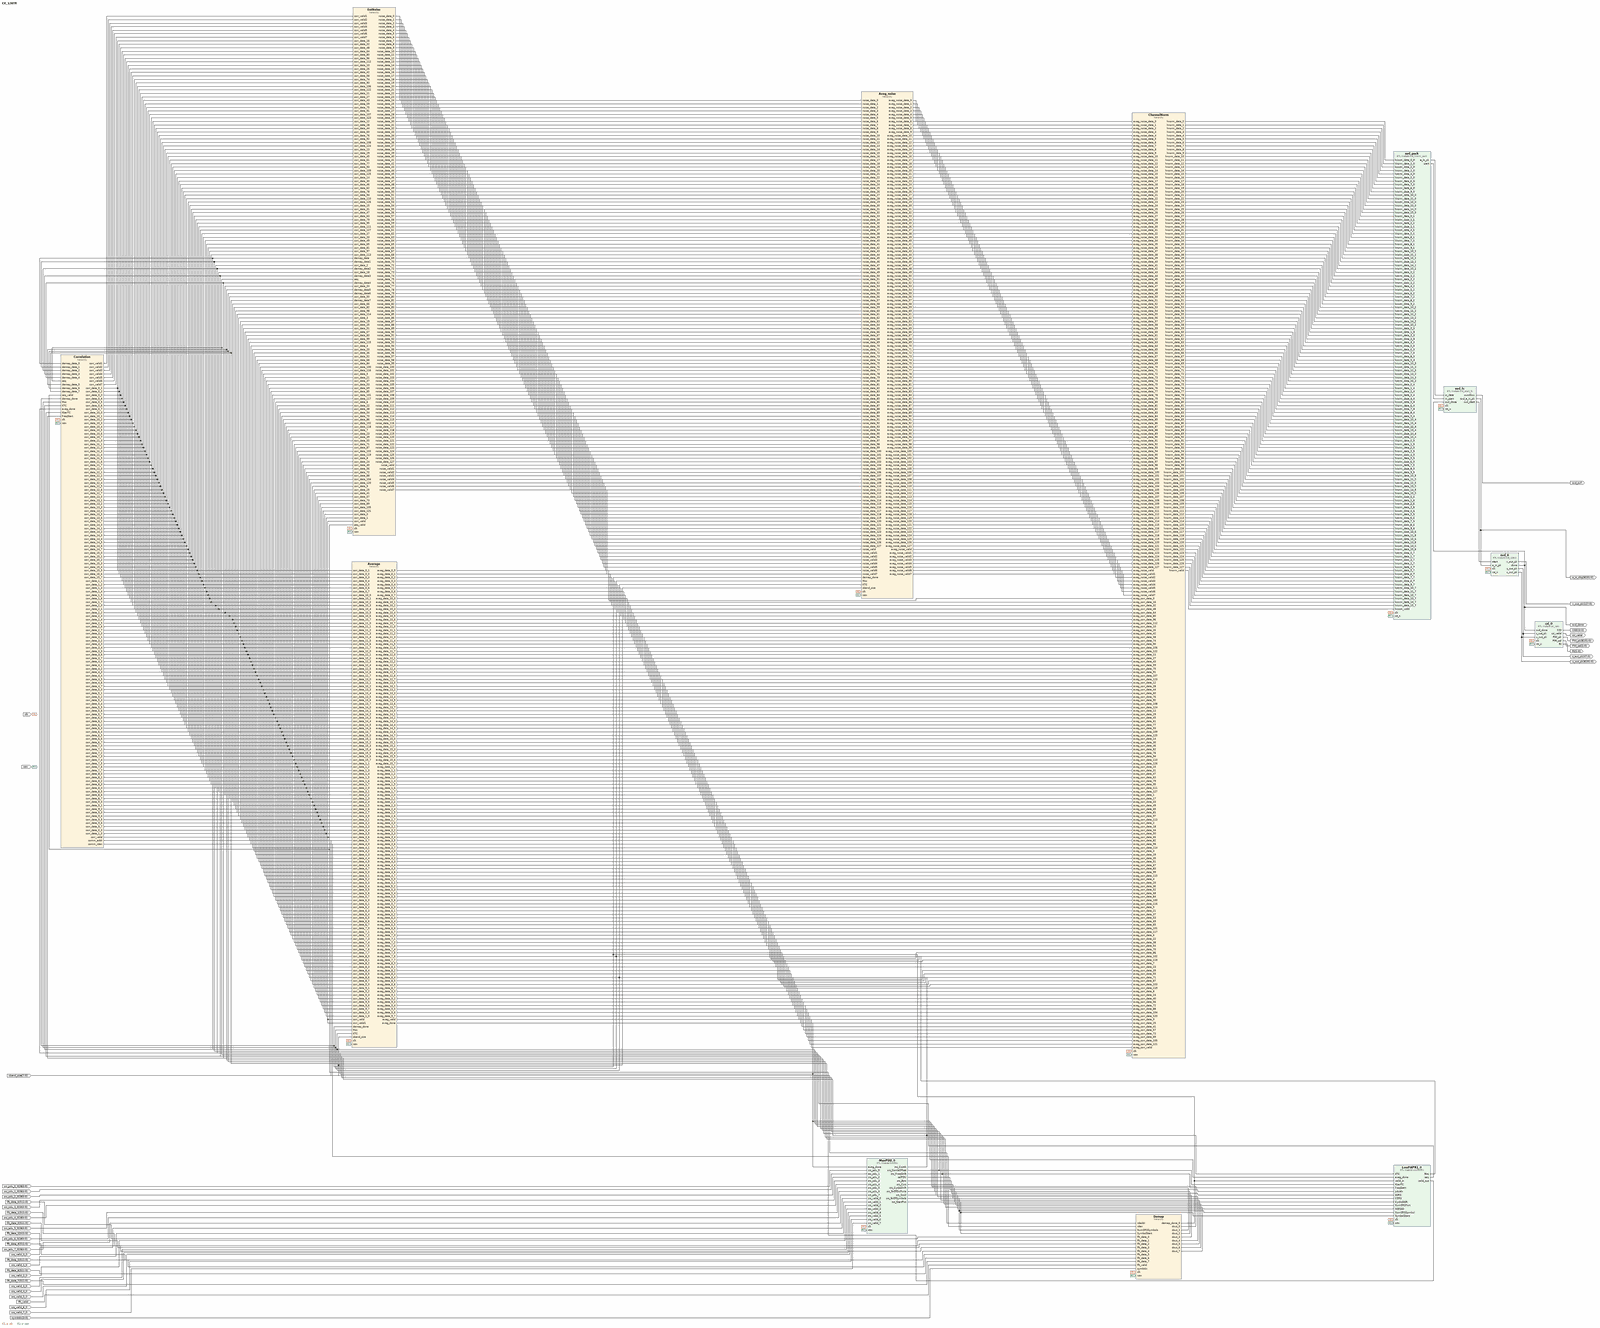
[diagram p0: block diagram of the top level, whole]
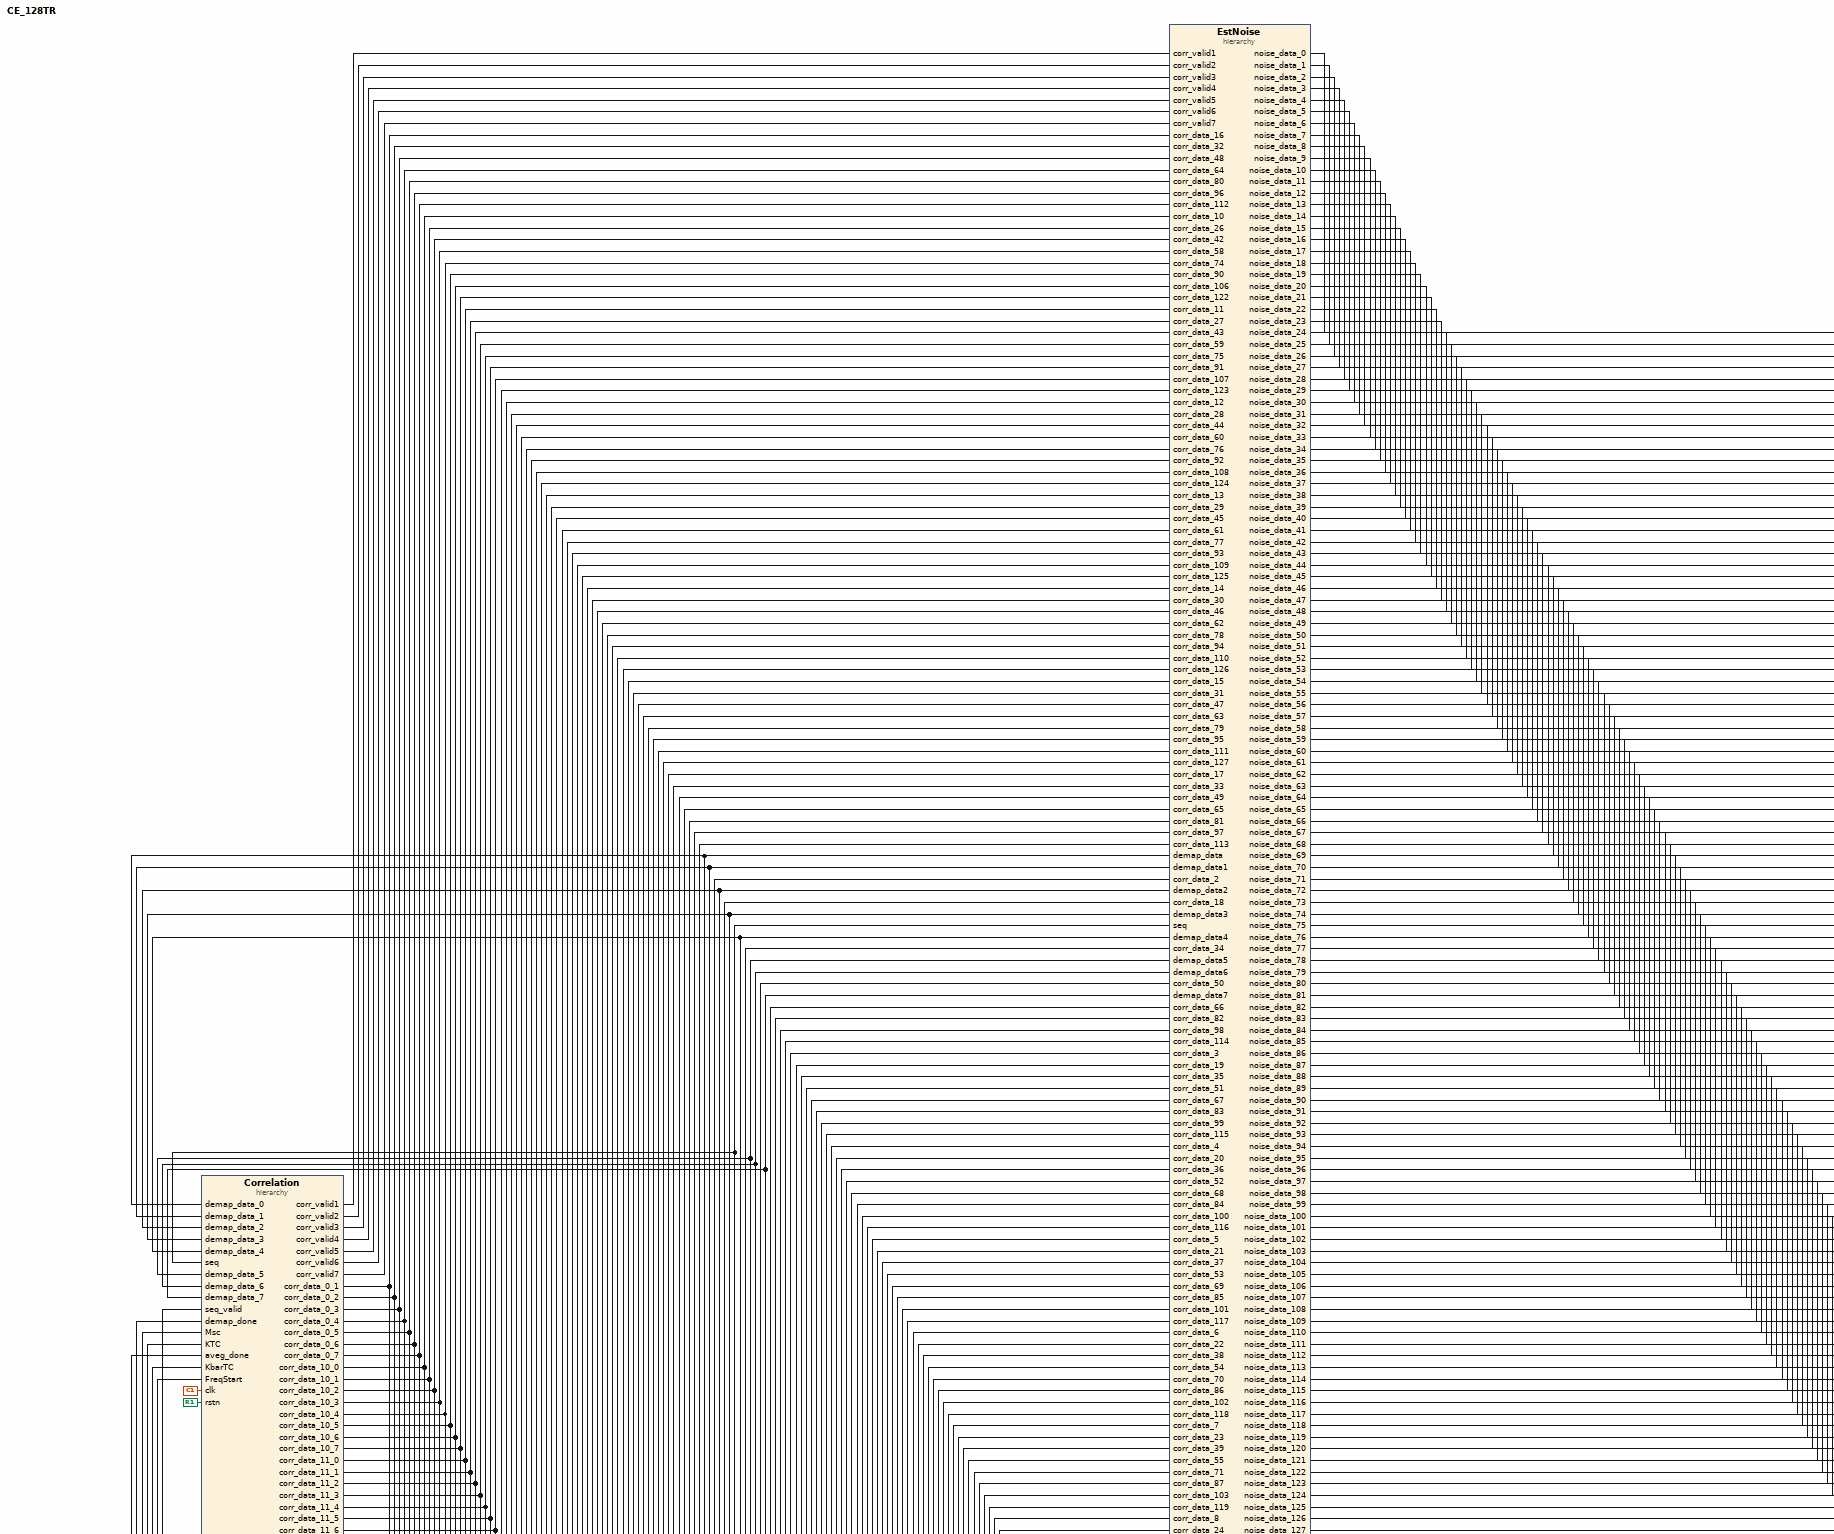
[diagram p1: block diagram of the top level, upper left part]
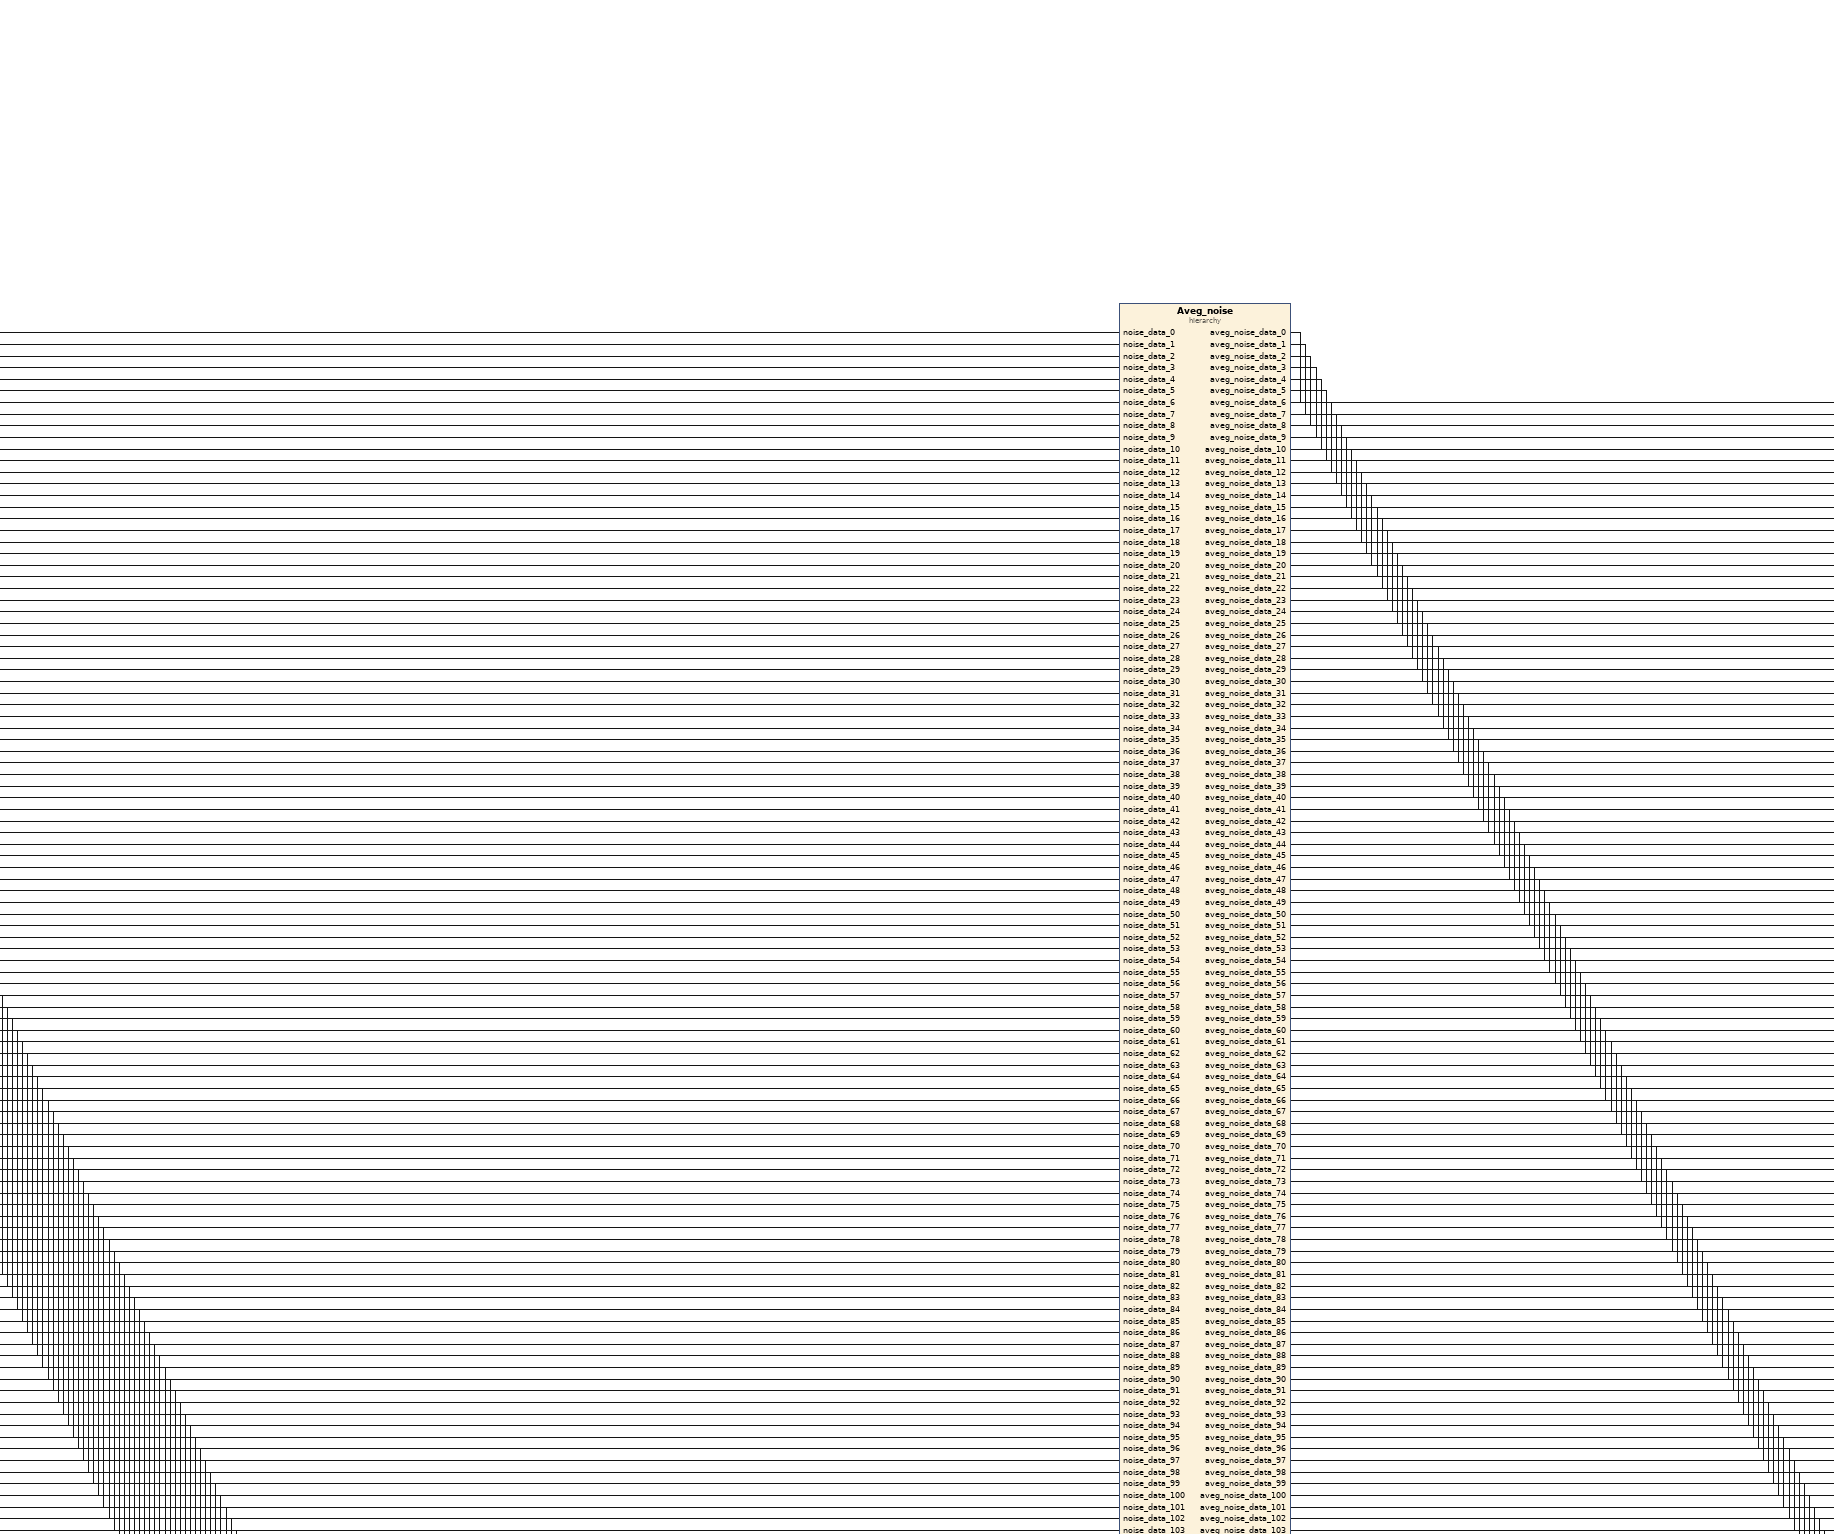
[diagram p2: block diagram of the top level, upper centre part]
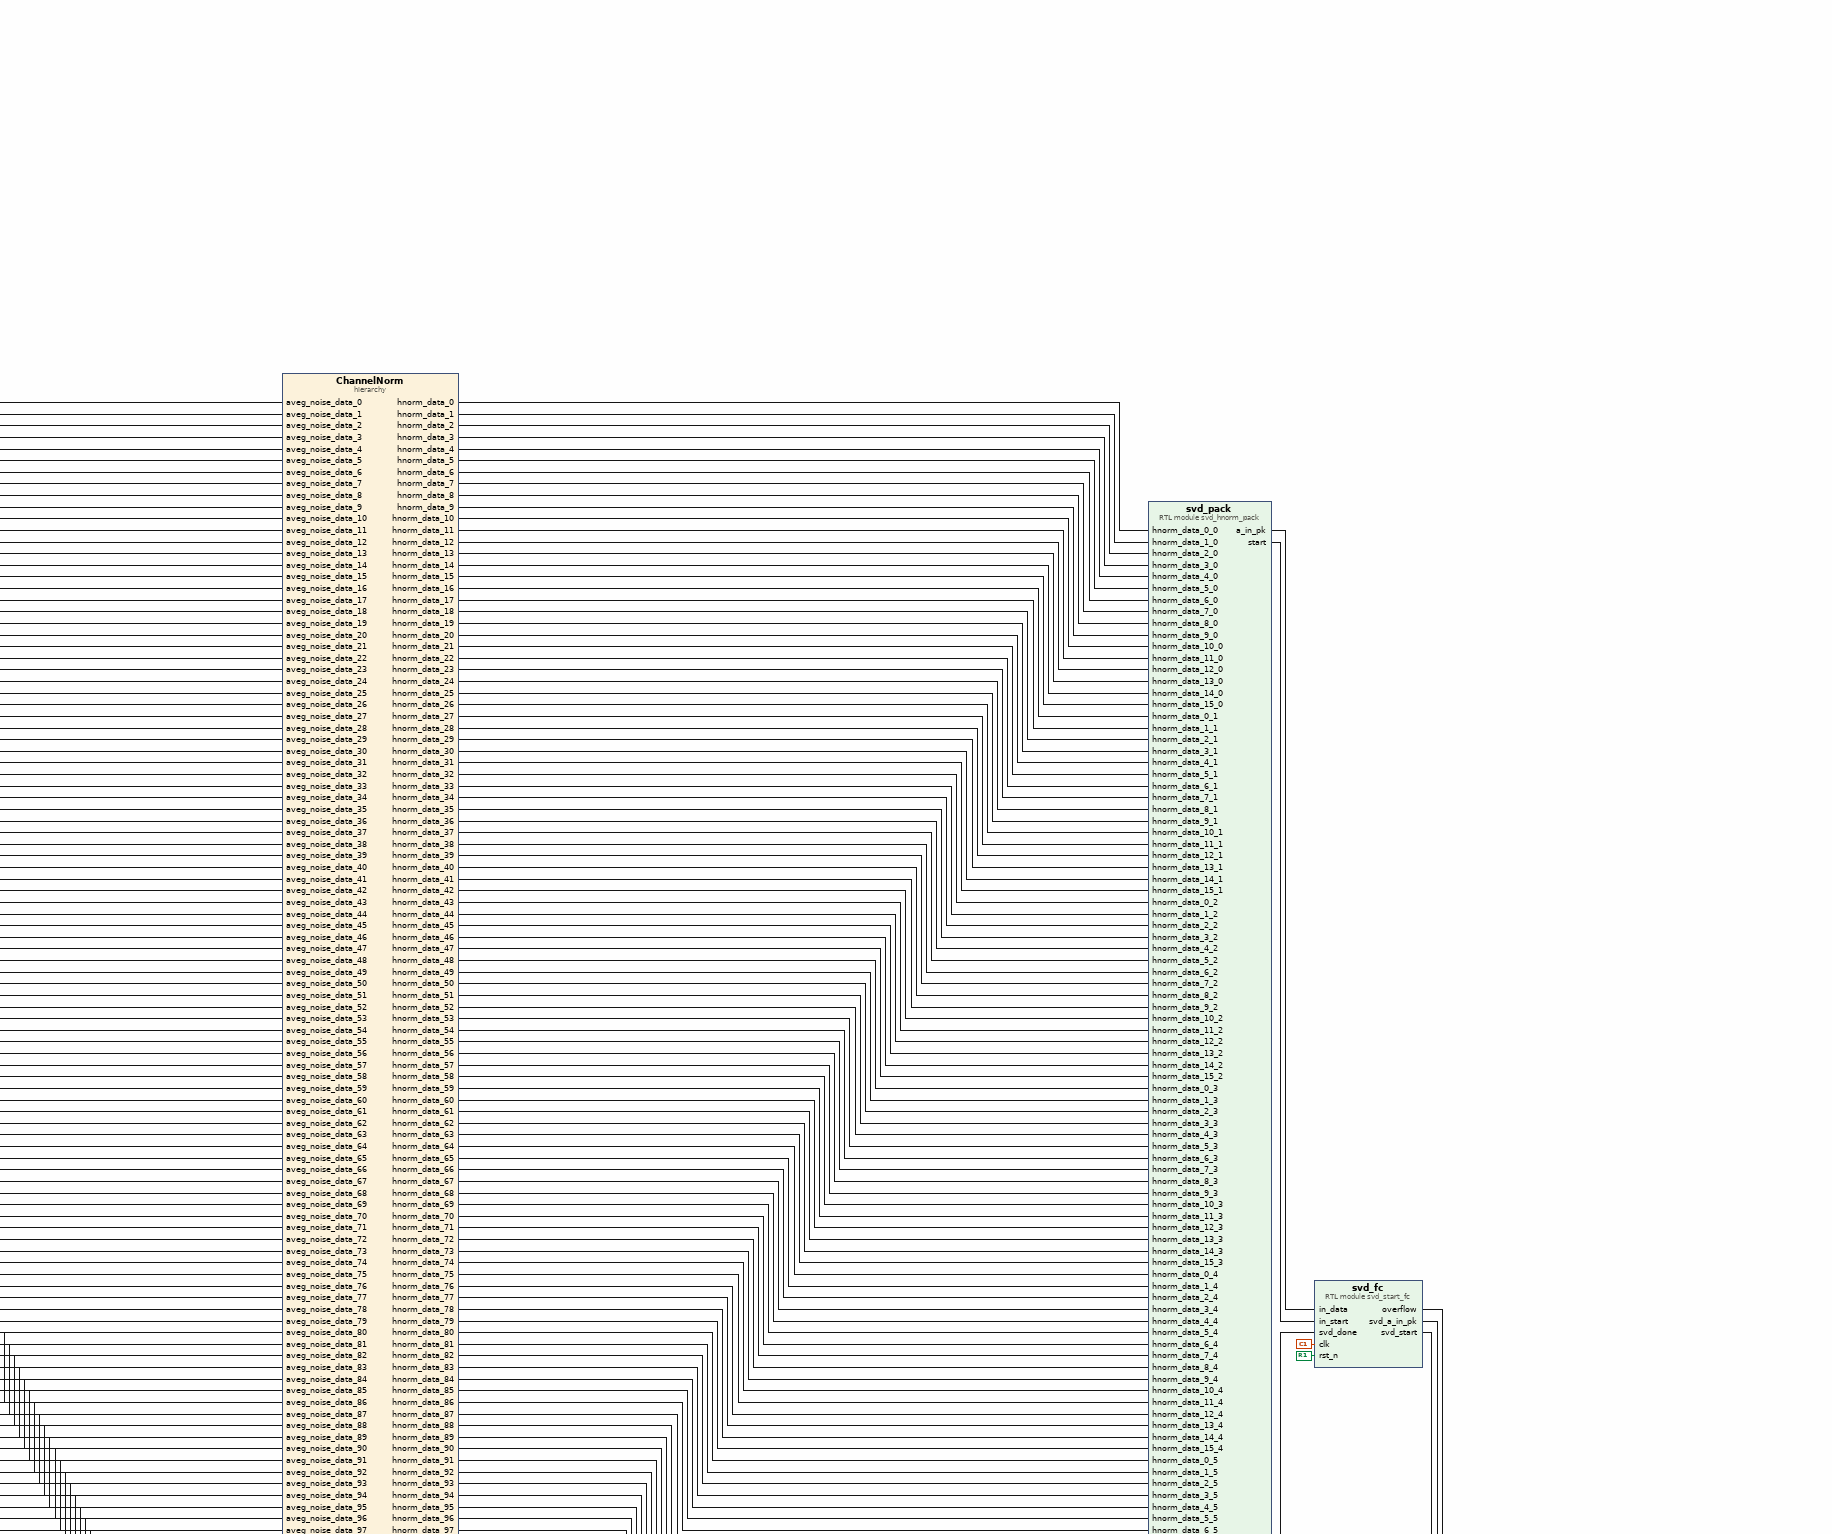
[diagram p3: block diagram of the top level, upper right part]
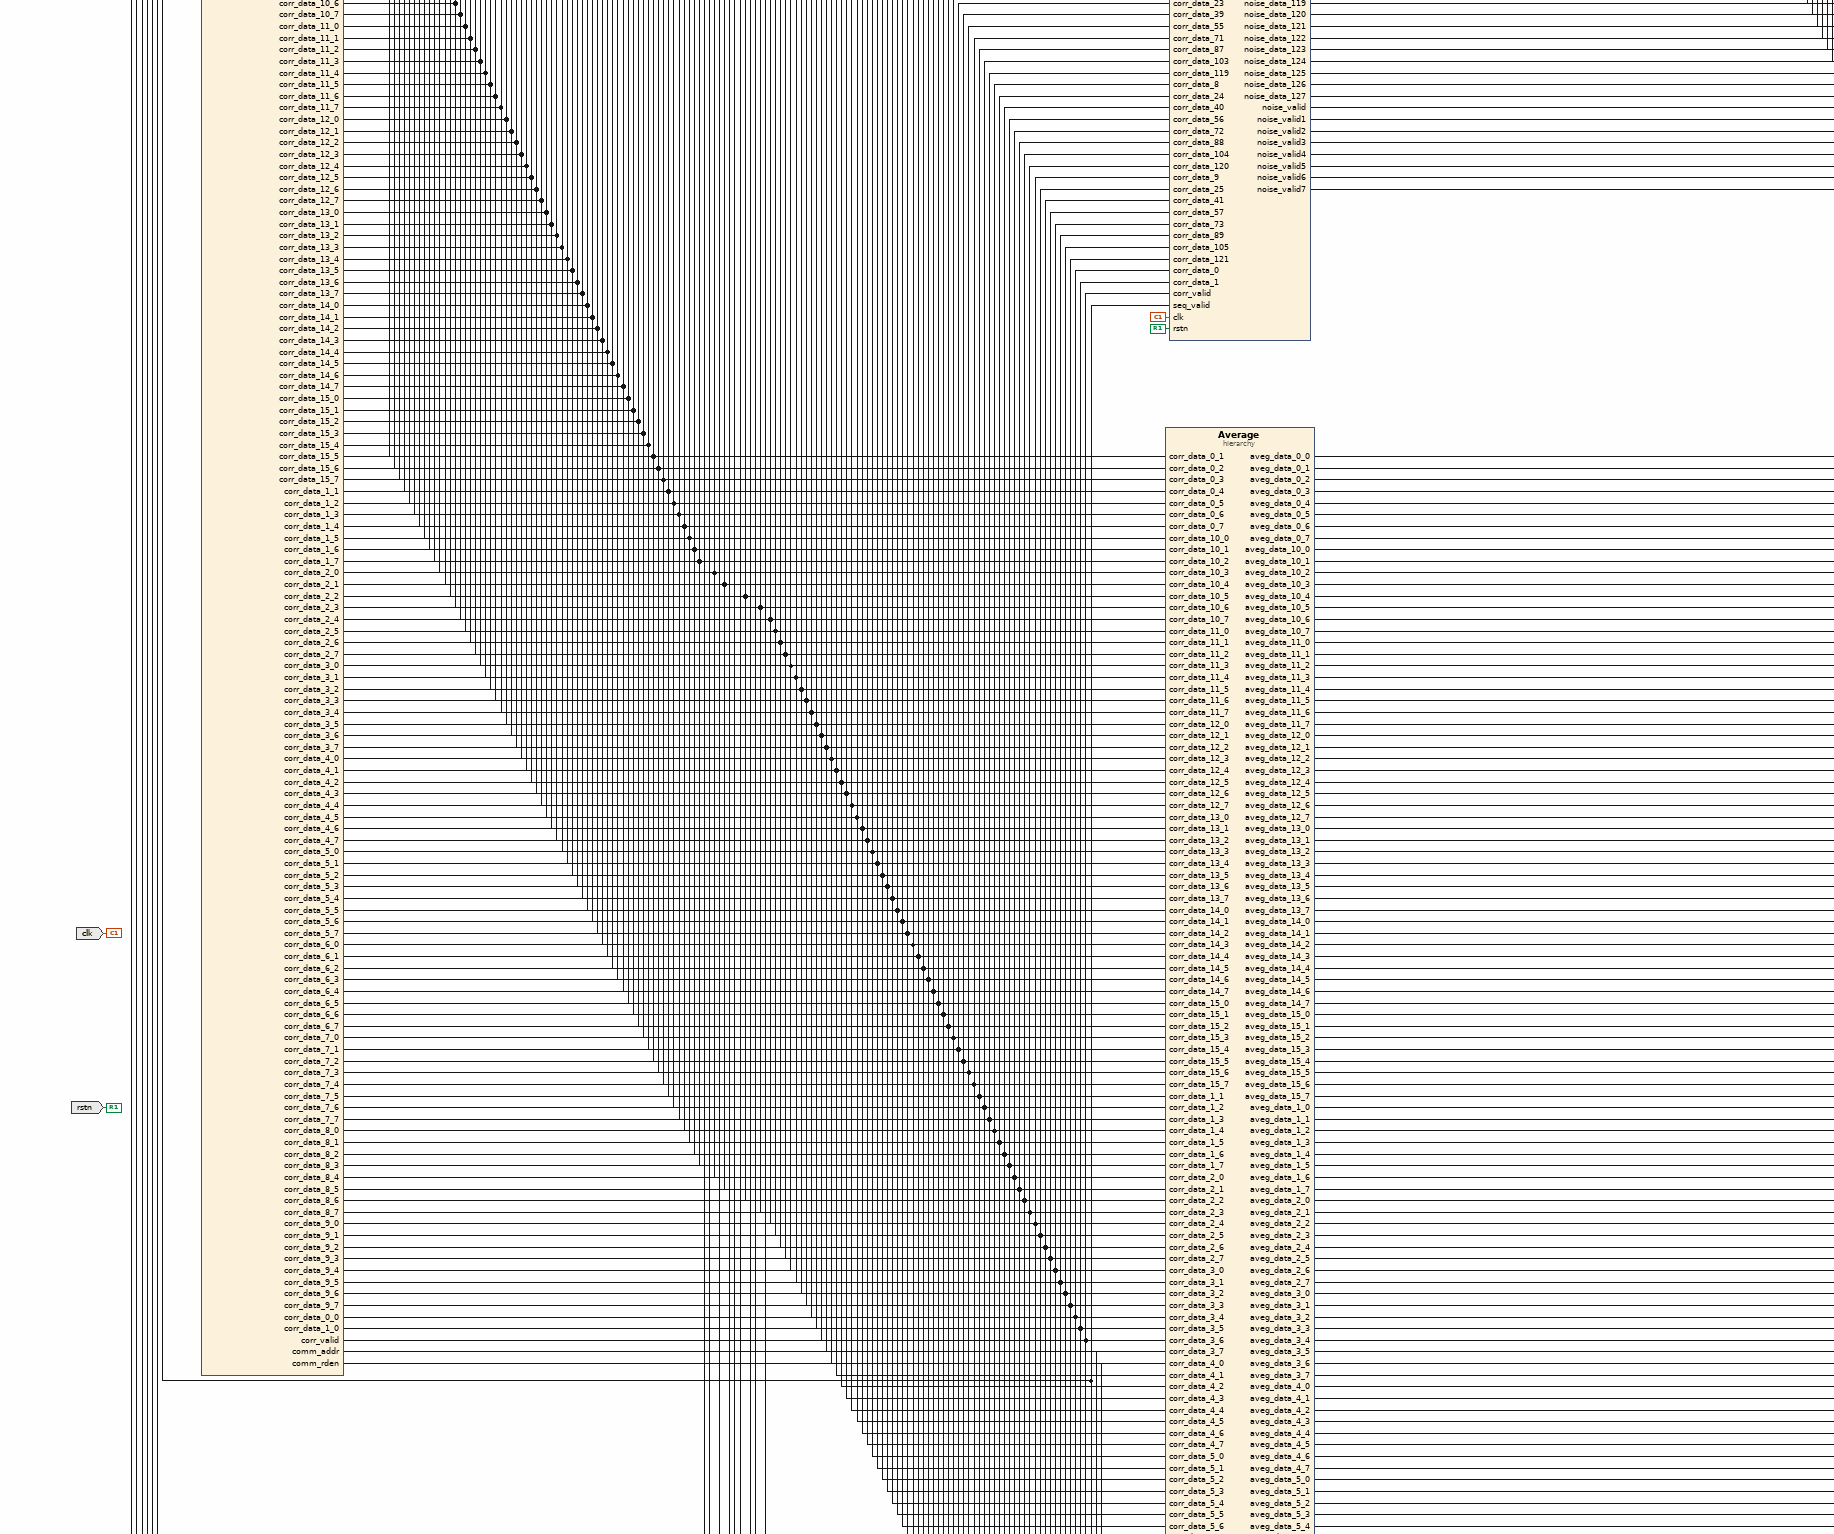
[diagram p4: block diagram of the top level, middle left part]
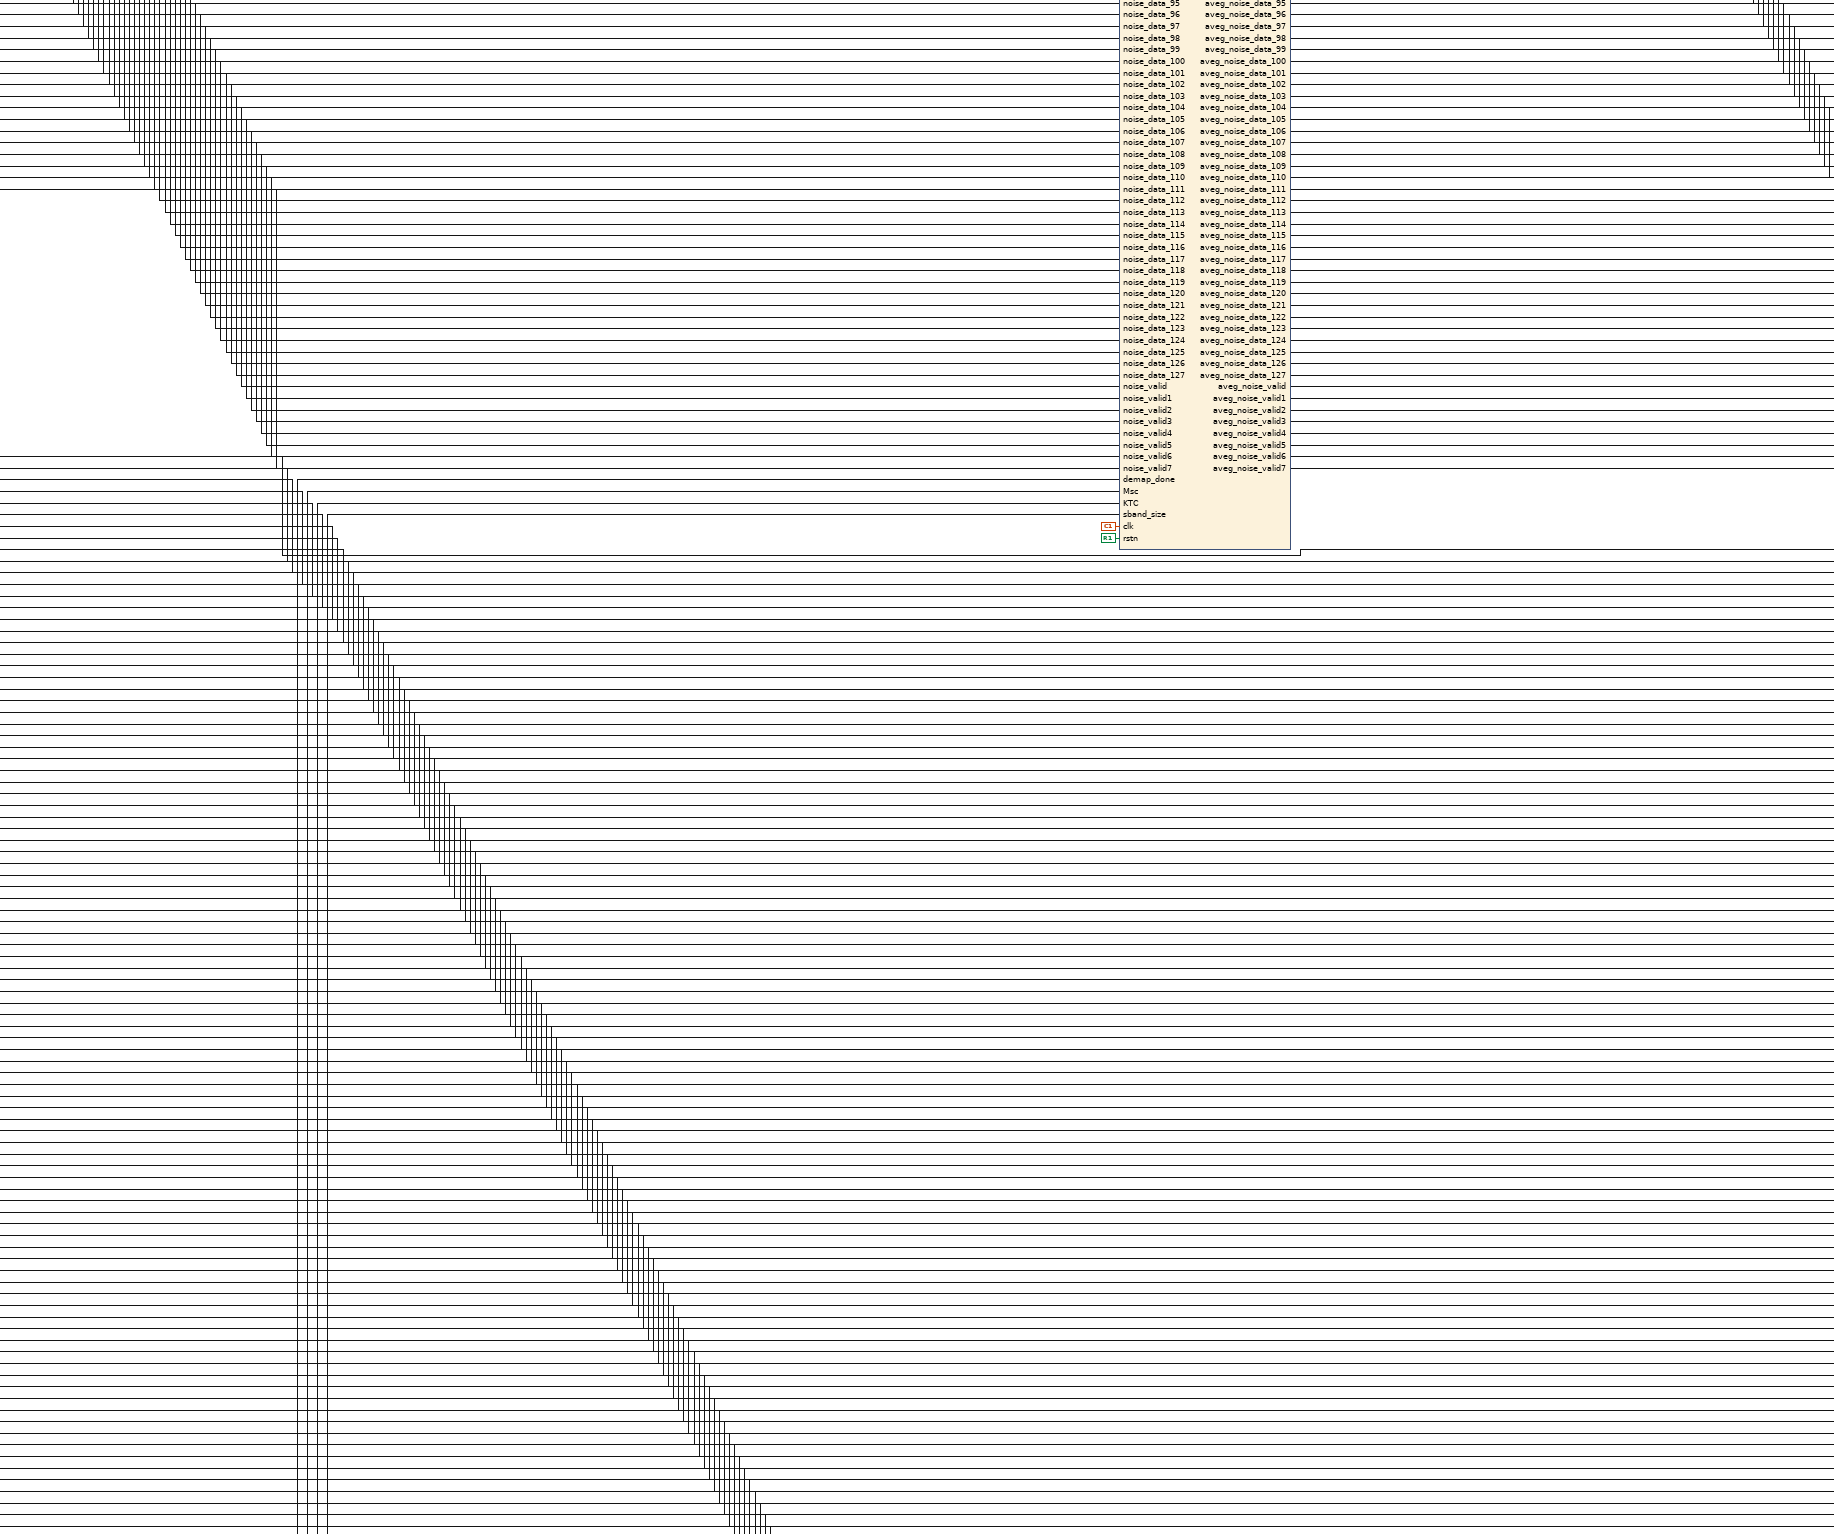
[diagram p5: block diagram of the top level, middle centre part]
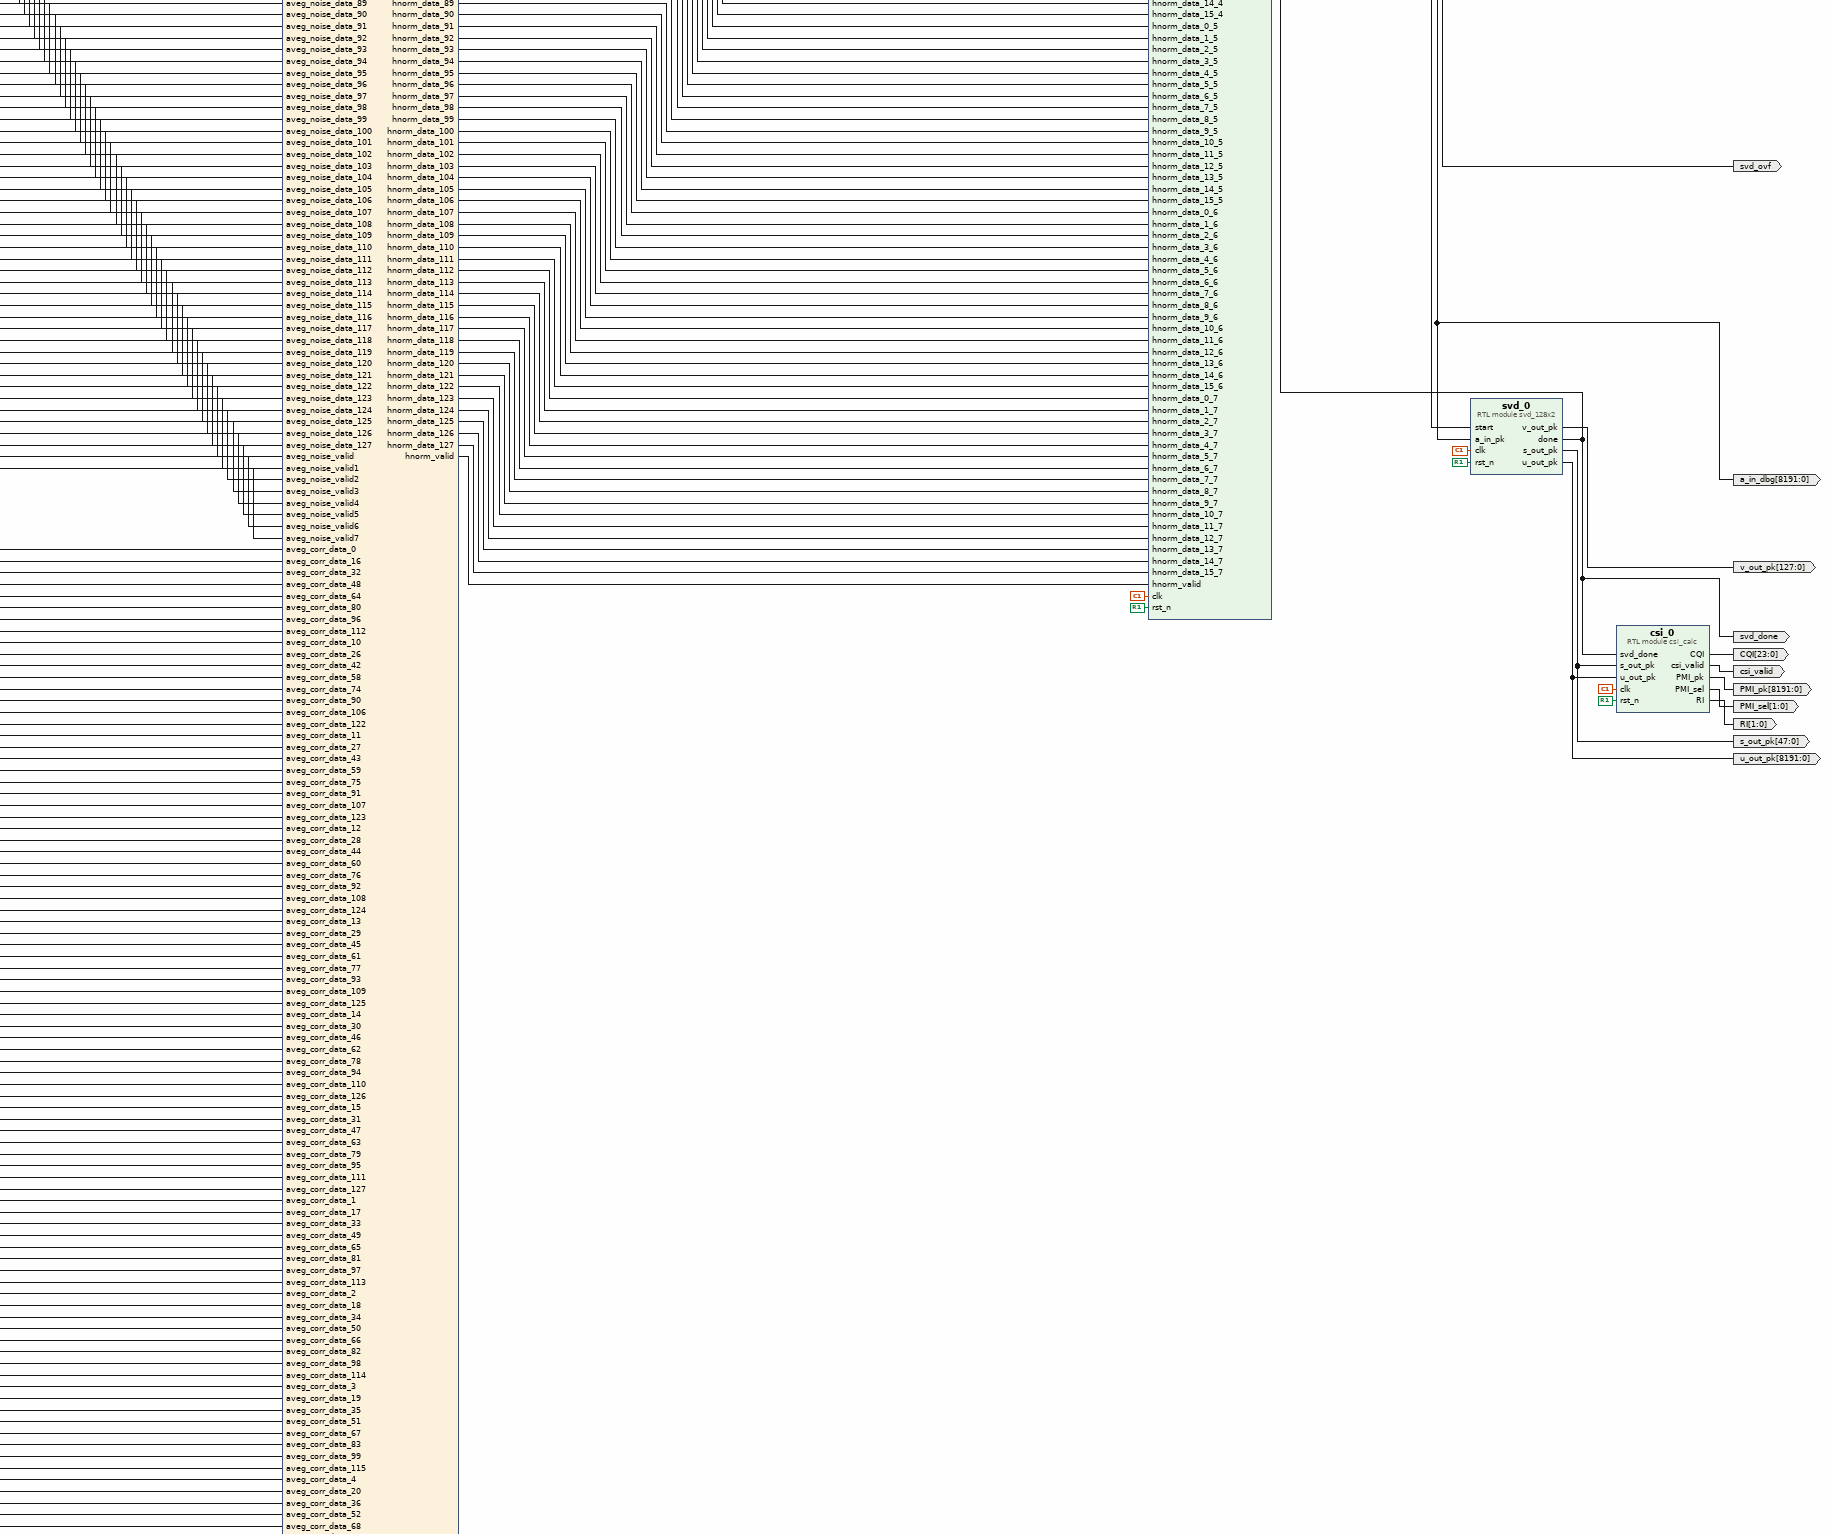
[diagram p6: block diagram of the top level, middle right part]
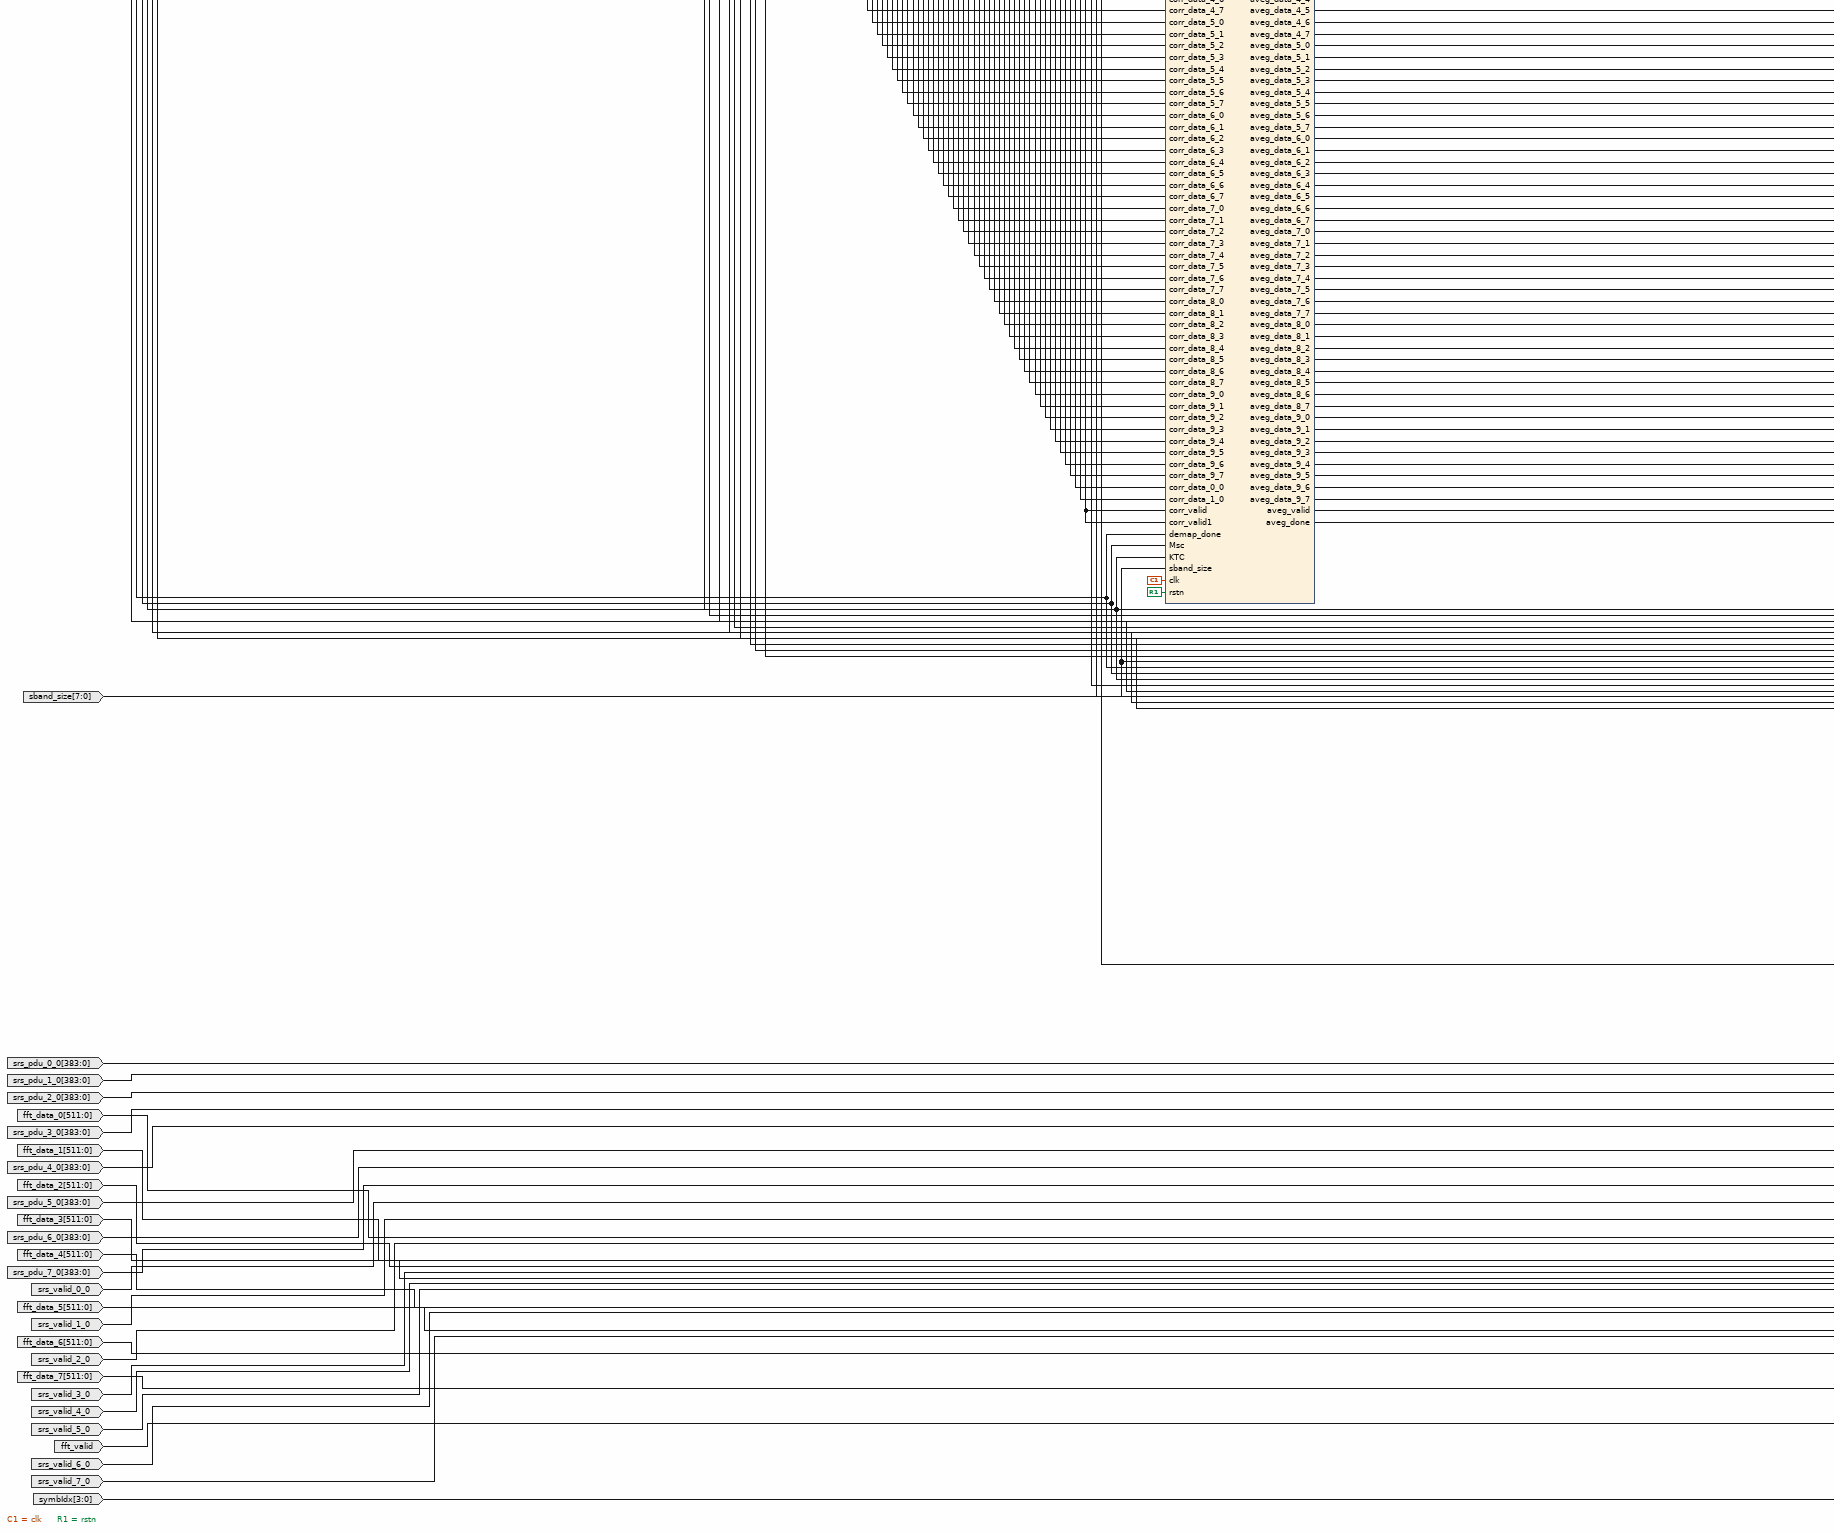
[diagram p7: block diagram of the top level, lower left part]
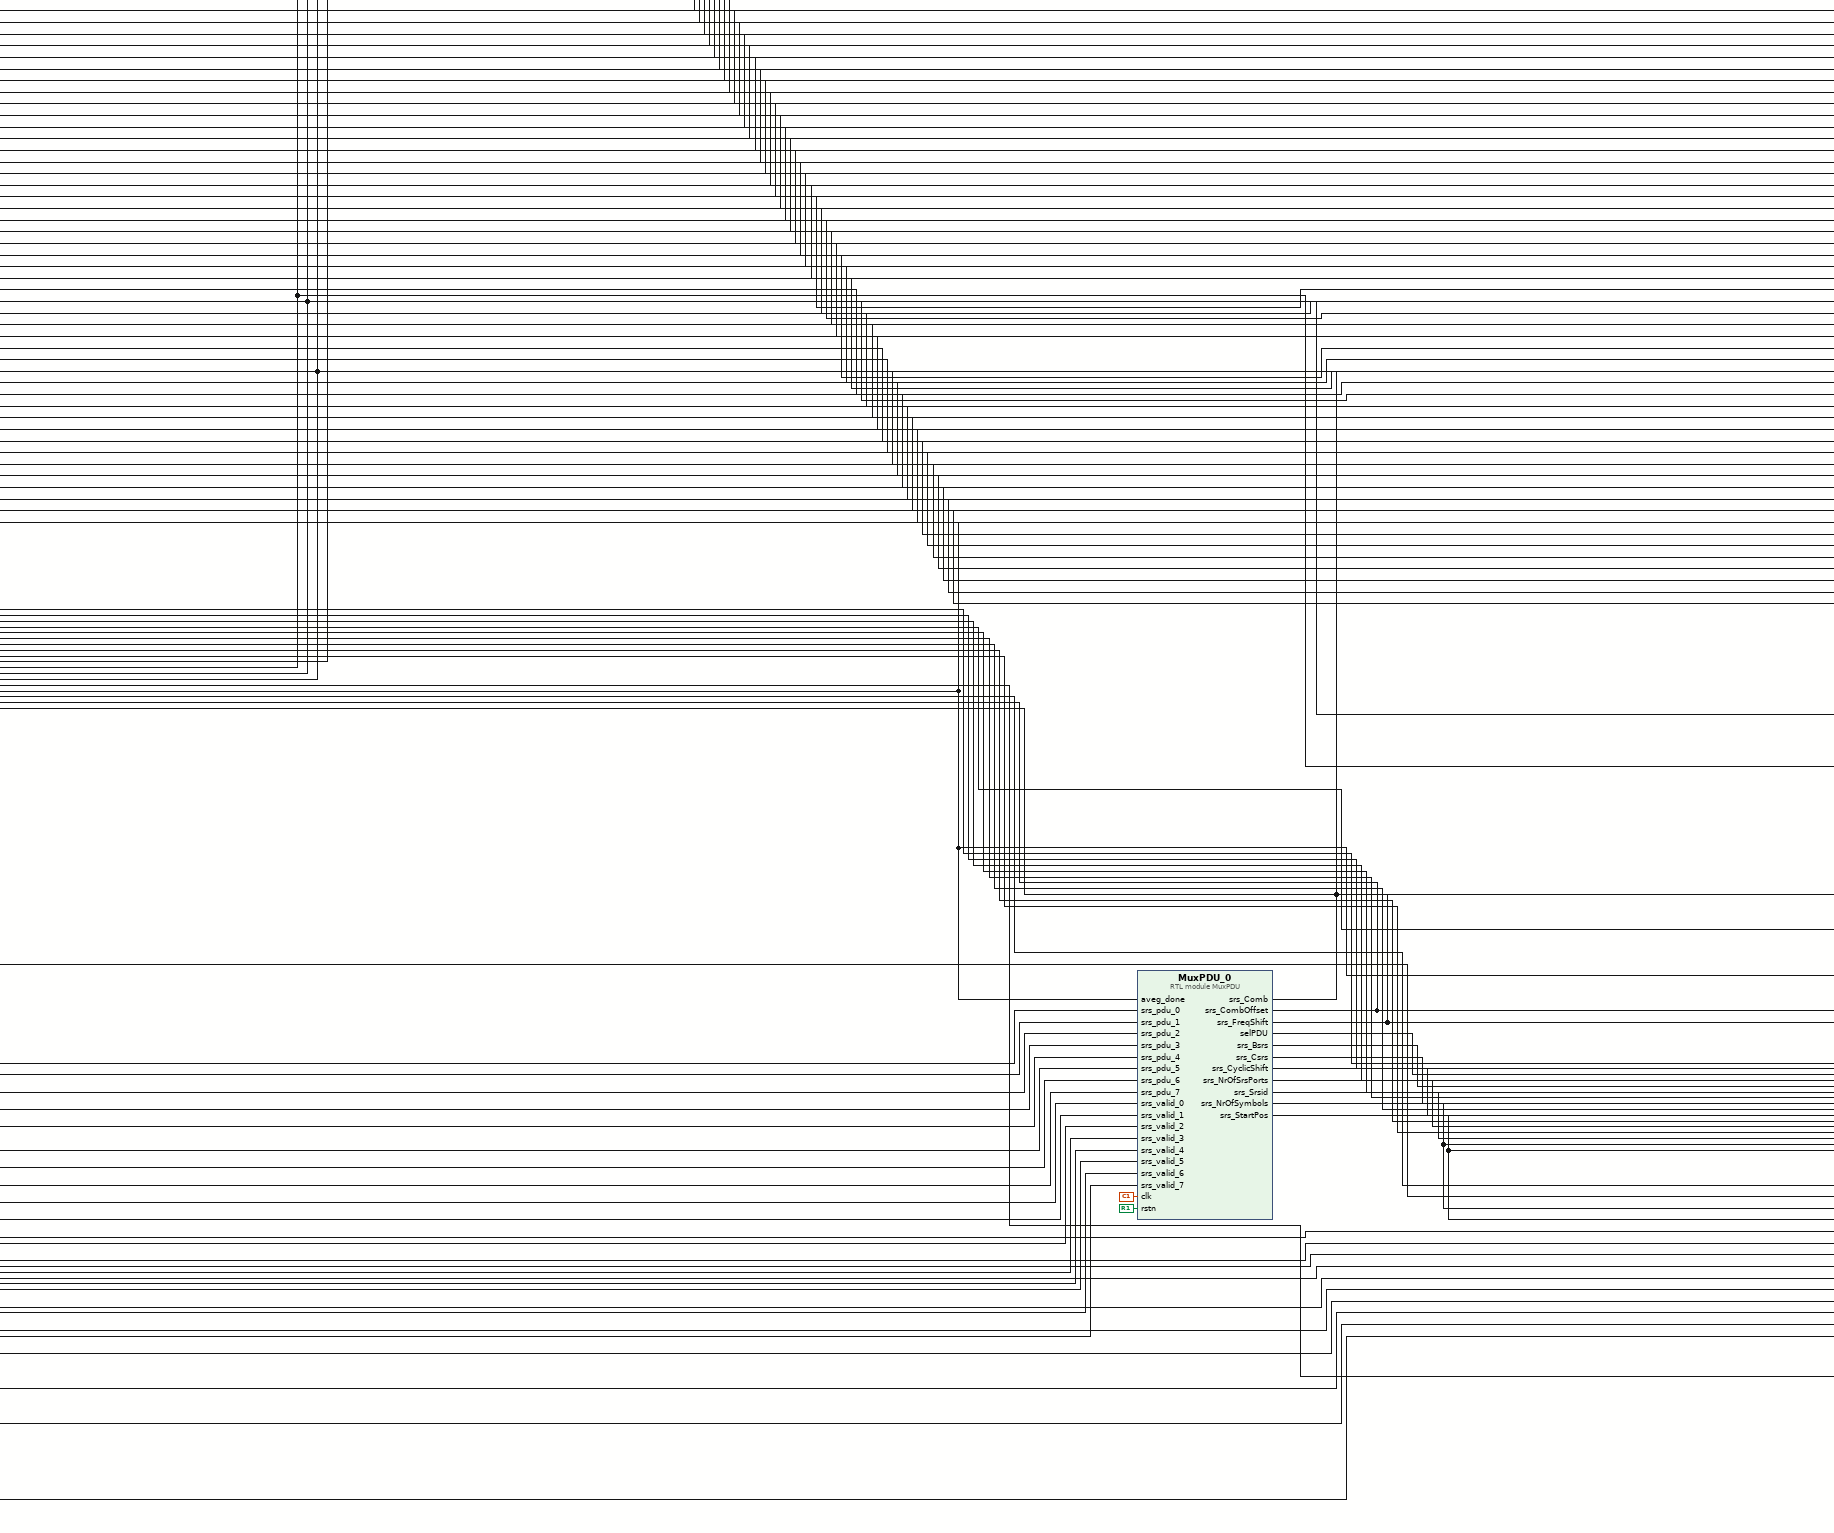
[diagram p8: block diagram of the top level, lower centre part]
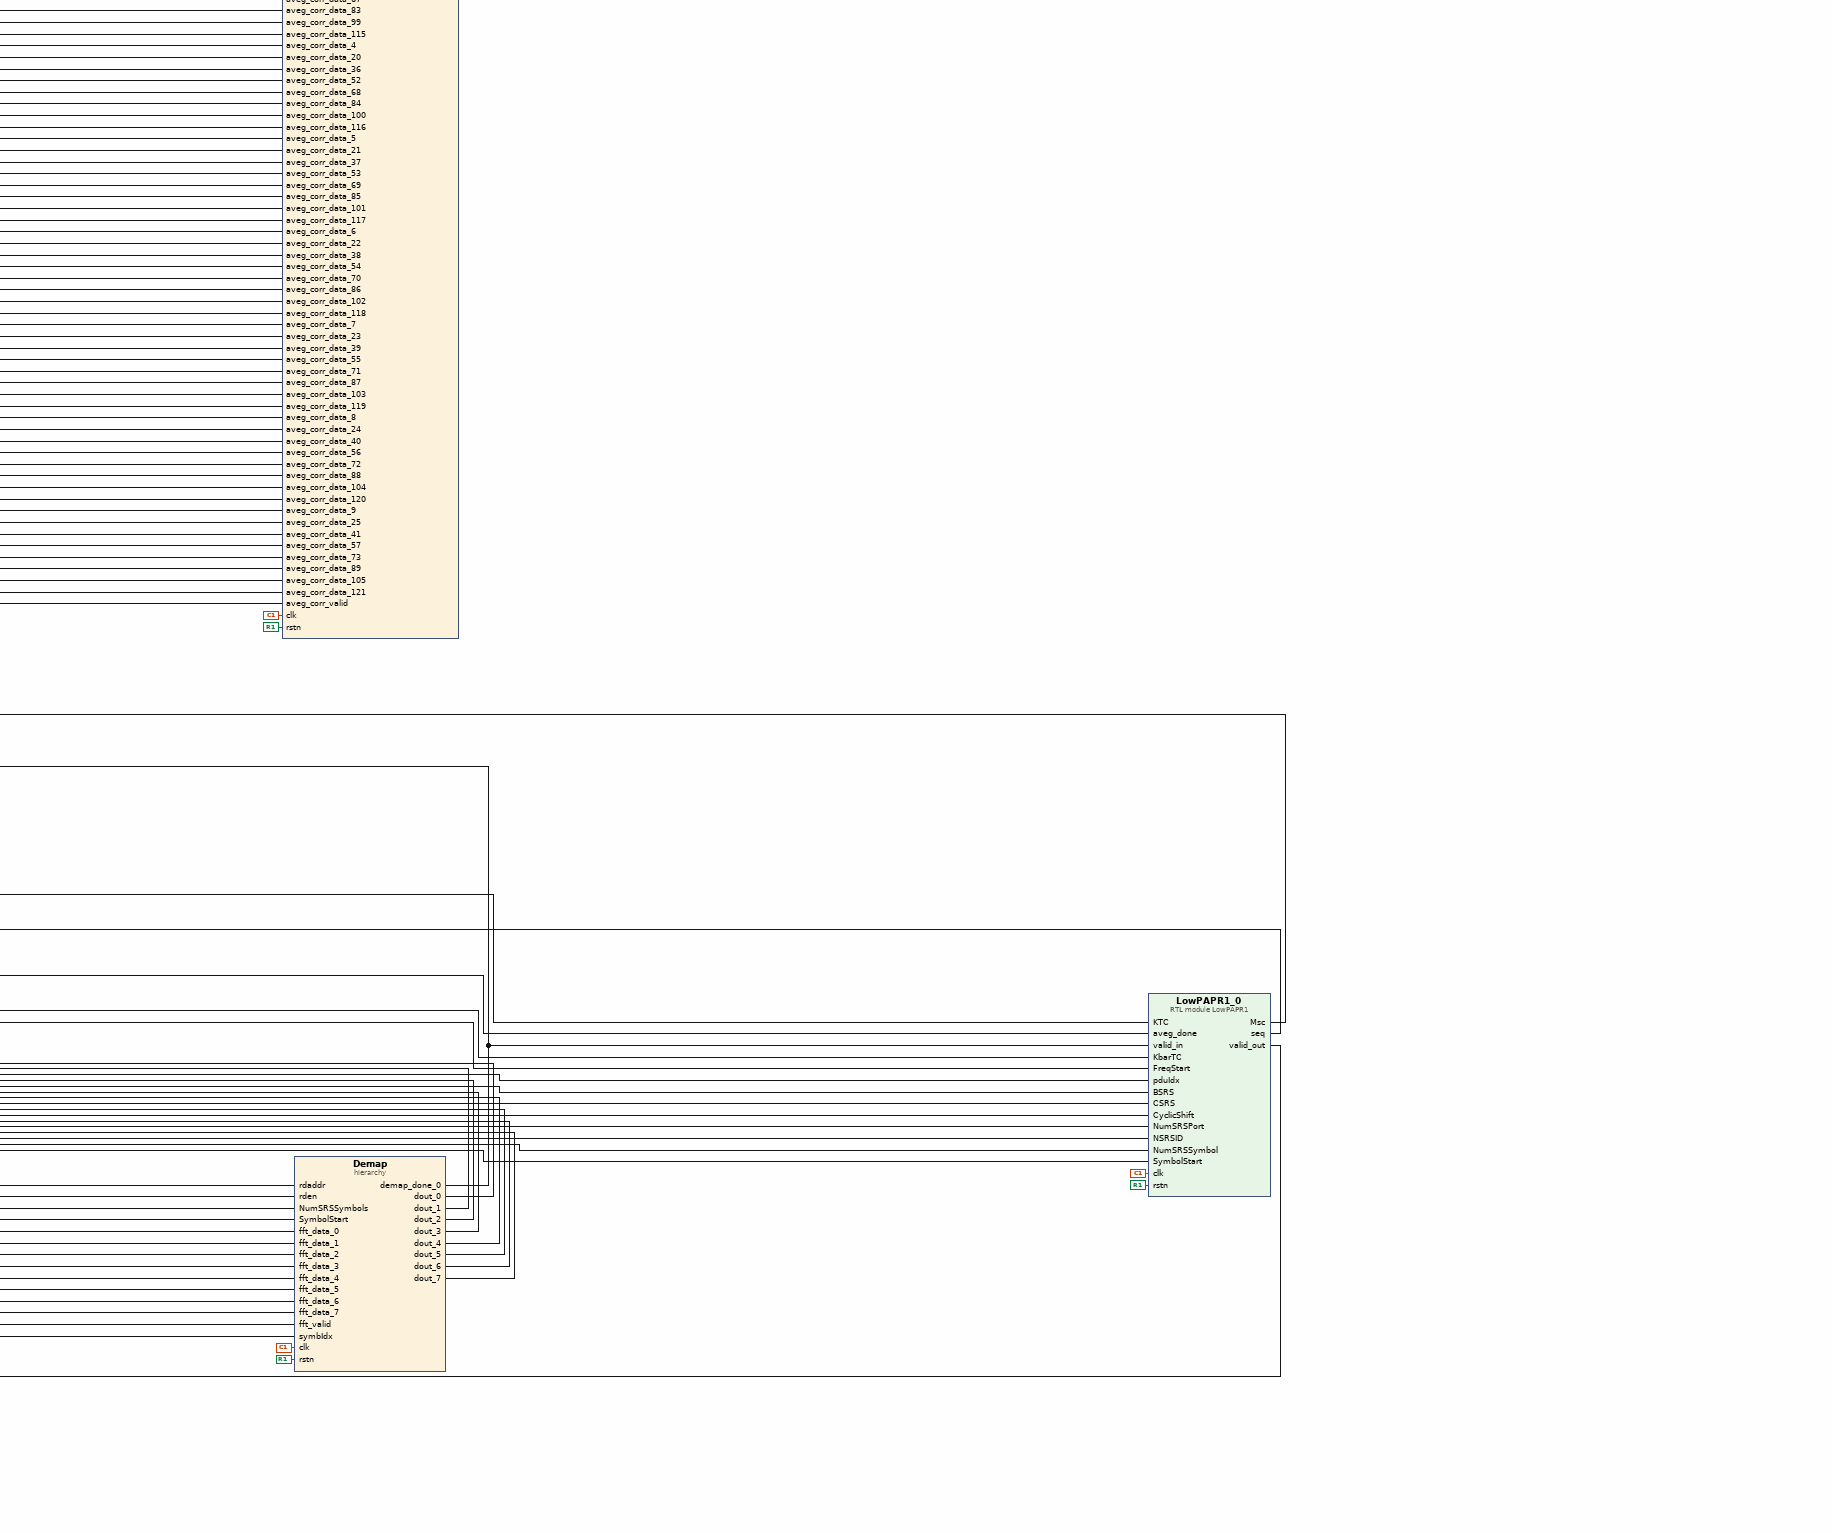
[diagram p9: block diagram of the top level, lower right part]
# Vivado block design CE_128TR, xczu19eg-ffvc1760-2-i, Vivado 2024.2
create_bd_design CE_128TR

create_bd_port -dir I -type clk clk
create_bd_port -dir I -type rst rstn
create_bd_port -dir I fft_valid
create_bd_port -dir I -from 511 -to 0 fft_data_0
create_bd_port -dir I -from 511 -to 0 fft_data_1
create_bd_port -dir I -from 511 -to 0 fft_data_2
create_bd_port -dir I -from 511 -to 0 fft_data_3
create_bd_port -dir I -from 511 -to 0 fft_data_4
create_bd_port -dir I -from 511 -to 0 fft_data_5
create_bd_port -dir I -from 511 -to 0 fft_data_6
create_bd_port -dir I -from 511 -to 0 fft_data_7
create_bd_port -dir I -from 3 -to 0 symbIdx
create_bd_port -dir I -from 383 -to 0 srs_pdu_0_0
create_bd_port -dir I -from 383 -to 0 srs_pdu_1_0
create_bd_port -dir I -from 383 -to 0 srs_pdu_2_0
create_bd_port -dir I -from 383 -to 0 srs_pdu_3_0
create_bd_port -dir I -from 383 -to 0 srs_pdu_4_0
create_bd_port -dir I -from 383 -to 0 srs_pdu_5_0
create_bd_port -dir I -from 383 -to 0 srs_pdu_6_0
create_bd_port -dir I -from 383 -to 0 srs_pdu_7_0
create_bd_port -dir I srs_valid_0_0
create_bd_port -dir I srs_valid_1_0
create_bd_port -dir I srs_valid_2_0
create_bd_port -dir I srs_valid_3_0
create_bd_port -dir I srs_valid_4_0
create_bd_port -dir I srs_valid_5_0
create_bd_port -dir I srs_valid_6_0
create_bd_port -dir I srs_valid_7_0
create_bd_port -dir I -from 7 -to 0 sband_size
create_bd_port -dir O svd_done
create_bd_port -dir O svd_ovf
create_bd_port -dir O -from 8191 -to 0 u_out_pk
create_bd_port -dir O -from 47 -to 0 s_out_pk
create_bd_port -dir O -from 127 -to 0 v_out_pk
create_bd_port -dir O -from 8191 -to 0 a_in_dbg
create_bd_port -dir O csi_valid
create_bd_port -dir O -from 1 -to 0 RI
create_bd_port -dir O -from 23 -to 0 CQI
create_bd_port -dir O -from 1 -to 0 PMI_sel
create_bd_port -dir O -from 8191 -to 0 PMI_pk

create_bd_cell -type module -reference LowPAPR1 LowPAPR1_0
create_bd_cell -type hier Demap
create_bd_cell -type hier Correlation
create_bd_cell -type hier Average
create_bd_cell -type module -reference MuxPDU MuxPDU_0
create_bd_cell -type hier EstNoise
create_bd_cell -type hier Aveg_noise
create_bd_cell -type hier ChannelNorm
create_bd_cell -type module -reference svd_hnorm_pack svd_pack
set_property -dict {CONFIG.N_INST 8 CONFIG.N_ROW 128 CONFIG.PORT 2 CONFIG.QUO_W 32 CONFIG.RX_PER 16} [get_bd_cells svd_pack]
create_bd_cell -type module -reference svd_start_fc svd_fc
set_property -dict {CONFIG.DEPTH 4 CONFIG.DW 8192} [get_bd_cells svd_fc]
create_bd_cell -type module -reference svd_128x2 svd_0
set_property -dict {CONFIG.N_PAR 8 CONFIG.N_ROW 128} [get_bd_cells svd_0]
create_bd_cell -type module -reference csi_calc csi_0
set_property -dict {CONFIG.N_ROW 128 CONFIG.THR_Q15 655} [get_bd_cells csi_0]

# ---- hierarchy /Demap ----
current_bd_instance /Demap
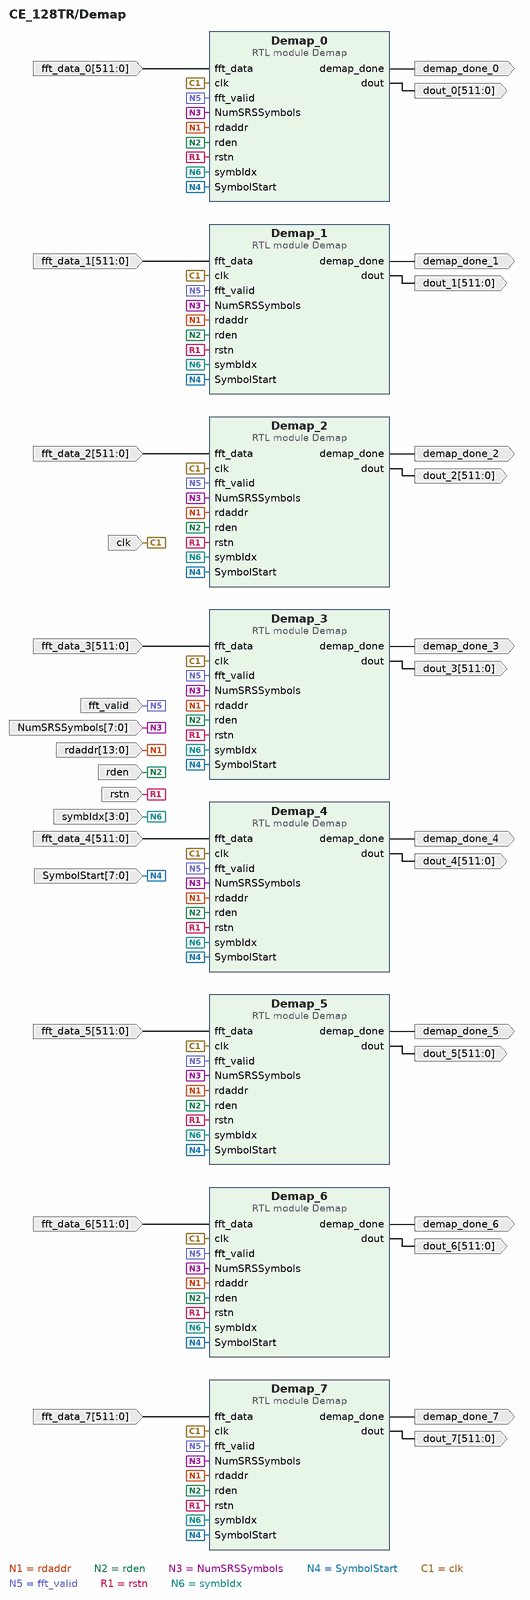
[diagram p10: block diagram inside /Demap]
create_bd_pin -dir I -type clk clk
create_bd_pin -dir I -type rst rstn
create_bd_pin -dir I fft_valid
create_bd_pin -dir I -from 511 -to 0 fft_data_0
create_bd_pin -dir I -from 511 -to 0 fft_data_1
create_bd_pin -dir I -from 511 -to 0 fft_data_2
create_bd_pin -dir I -from 511 -to 0 fft_data_3
create_bd_pin -dir I -from 511 -to 0 fft_data_4
create_bd_pin -dir I -from 511 -to 0 fft_data_5
create_bd_pin -dir I -from 511 -to 0 fft_data_6
create_bd_pin -dir I -from 511 -to 0 fft_data_7
create_bd_pin -dir I -from 3 -to 0 symbIdx
create_bd_pin -dir I -from 7 -to 0 NumSRSSymbols
create_bd_pin -dir I -from 7 -to 0 SymbolStart
create_bd_pin -dir I rden
create_bd_pin -dir I -from 13 -to 0 rdaddr
create_bd_pin -dir O -from 511 -to 0 dout_0
create_bd_pin -dir O -from 511 -to 0 dout_1
create_bd_pin -dir O -from 511 -to 0 dout_2
create_bd_pin -dir O -from 511 -to 0 dout_3
create_bd_pin -dir O -from 511 -to 0 dout_4
create_bd_pin -dir O -from 511 -to 0 dout_5
create_bd_pin -dir O -from 511 -to 0 dout_6
create_bd_pin -dir O -from 511 -to 0 dout_7
create_bd_pin -dir O demap_done_0
create_bd_pin -dir O demap_done_1
create_bd_pin -dir O demap_done_2
create_bd_pin -dir O demap_done_3
create_bd_pin -dir O demap_done_4
create_bd_pin -dir O demap_done_5
create_bd_pin -dir O demap_done_6
create_bd_pin -dir O demap_done_7

create_bd_cell -type module -reference Demap Demap_0
set_property -dict {CONFIG.PARA 16} [get_bd_cells Demap_0]
create_bd_cell -type module -reference Demap Demap_1
set_property -dict {CONFIG.PARA 16} [get_bd_cells Demap_1]
create_bd_cell -type module -reference Demap Demap_2
set_property -dict {CONFIG.PARA 16} [get_bd_cells Demap_2]
create_bd_cell -type module -reference Demap Demap_3
set_property -dict {CONFIG.PARA 16} [get_bd_cells Demap_3]
create_bd_cell -type module -reference Demap Demap_4
set_property -dict {CONFIG.PARA 16} [get_bd_cells Demap_4]
create_bd_cell -type module -reference Demap Demap_5
set_property -dict {CONFIG.PARA 16} [get_bd_cells Demap_5]
create_bd_cell -type module -reference Demap Demap_6
set_property -dict {CONFIG.PARA 16} [get_bd_cells Demap_6]
create_bd_cell -type module -reference Demap Demap_7
set_property -dict {CONFIG.PARA 16} [get_bd_cells Demap_7]

# ---- hierarchy /Correlation ----
current_bd_instance /Correlation
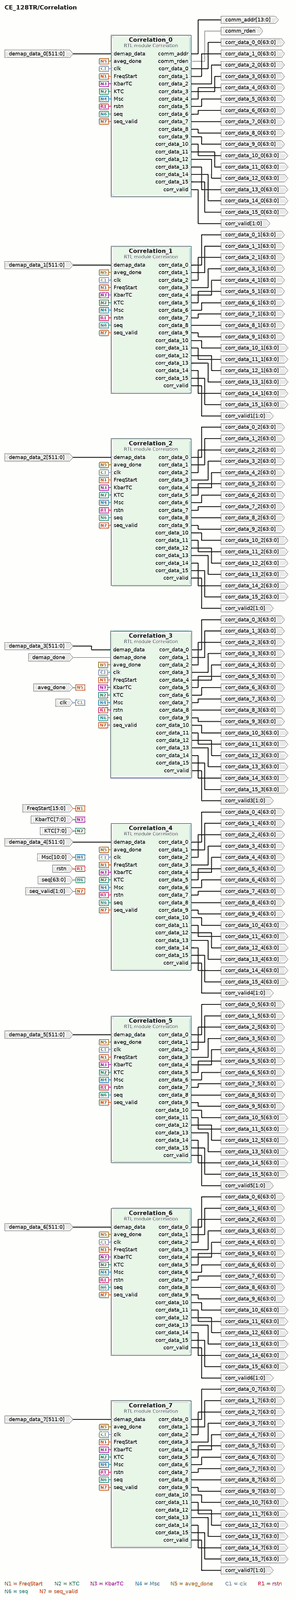
[diagram p11: block diagram inside /Correlation, whole]
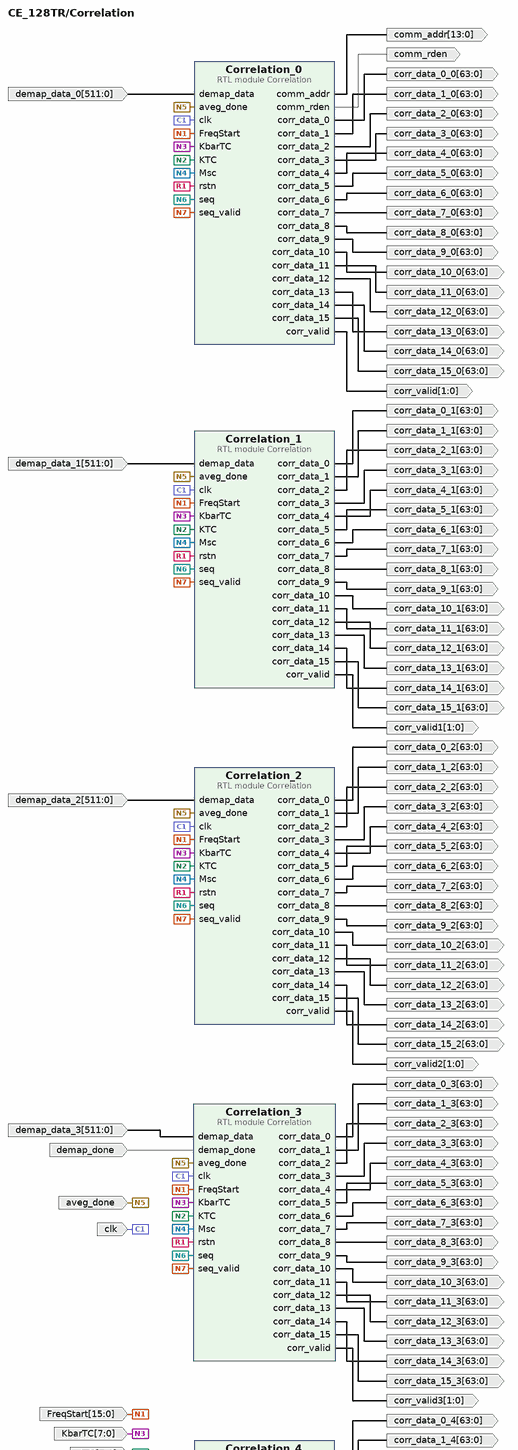
[diagram p12: block diagram inside /Correlation, upper part]
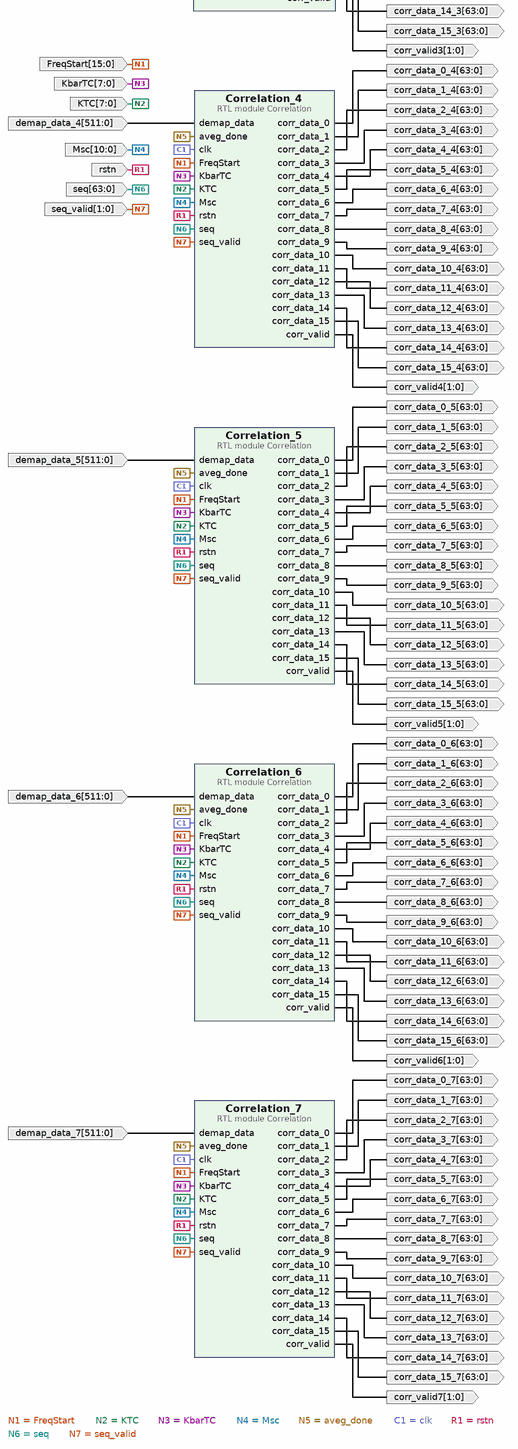
[diagram p13: block diagram inside /Correlation, lower part]
create_bd_pin -dir I clk
create_bd_pin -dir I rstn
create_bd_pin -dir I -from 7 -to 0 KTC
create_bd_pin -dir I -from 7 -to 0 KbarTC
create_bd_pin -dir I -from 15 -to 0 FreqStart
create_bd_pin -dir I -from 10 -to 0 Msc
create_bd_pin -dir I -from 1 -to 0 seq_valid
create_bd_pin -dir I -from 63 -to 0 seq
create_bd_pin -dir I -from 511 -to 0 demap_data_0
create_bd_pin -dir I -from 511 -to 0 demap_data_1
create_bd_pin -dir I -from 511 -to 0 demap_data_2
create_bd_pin -dir I -from 511 -to 0 demap_data_3
create_bd_pin -dir I -from 511 -to 0 demap_data_4
create_bd_pin -dir I -from 511 -to 0 demap_data_5
create_bd_pin -dir I -from 511 -to 0 demap_data_6
create_bd_pin -dir I -from 511 -to 0 demap_data_7
create_bd_pin -dir O -from 63 -to 0 corr_data_0_0
create_bd_pin -dir O -from 63 -to 0 corr_data_1_0
create_bd_pin -dir O -from 63 -to 0 corr_data_2_0
create_bd_pin -dir O -from 63 -to 0 corr_data_3_0
create_bd_pin -dir O -from 63 -to 0 corr_data_4_0
create_bd_pin -dir O -from 63 -to 0 corr_data_5_0
create_bd_pin -dir O -from 63 -to 0 corr_data_6_0
create_bd_pin -dir O -from 63 -to 0 corr_data_7_0
create_bd_pin -dir O -from 63 -to 0 corr_data_8_0
create_bd_pin -dir O -from 63 -to 0 corr_data_9_0
create_bd_pin -dir O -from 63 -to 0 corr_data_10_0
create_bd_pin -dir O -from 63 -to 0 corr_data_11_0
create_bd_pin -dir O -from 63 -to 0 corr_data_12_0
create_bd_pin -dir O -from 63 -to 0 corr_data_13_0
create_bd_pin -dir O -from 63 -to 0 corr_data_14_0
create_bd_pin -dir O -from 63 -to 0 corr_data_15_0
create_bd_pin -dir O -from 63 -to 0 corr_data_0_1
create_bd_pin -dir O -from 63 -to 0 corr_data_1_1
create_bd_pin -dir O -from 63 -to 0 corr_data_2_1
create_bd_pin -dir O -from 63 -to 0 corr_data_3_1
create_bd_pin -dir O -from 63 -to 0 corr_data_4_1
create_bd_pin -dir O -from 63 -to 0 corr_data_5_1
create_bd_pin -dir O -from 63 -to 0 corr_data_6_1
create_bd_pin -dir O -from 63 -to 0 corr_data_7_1
create_bd_pin -dir O -from 63 -to 0 corr_data_8_1
create_bd_pin -dir O -from 63 -to 0 corr_data_9_1
create_bd_pin -dir O -from 63 -to 0 corr_data_10_1
create_bd_pin -dir O -from 63 -to 0 corr_data_11_1
create_bd_pin -dir O -from 63 -to 0 corr_data_12_1
create_bd_pin -dir O -from 63 -to 0 corr_data_13_1
create_bd_pin -dir O -from 63 -to 0 corr_data_14_1
create_bd_pin -dir O -from 63 -to 0 corr_data_15_1
create_bd_pin -dir O -from 63 -to 0 corr_data_0_2
create_bd_pin -dir O -from 63 -to 0 corr_data_1_2
create_bd_pin -dir O -from 63 -to 0 corr_data_2_2
create_bd_pin -dir O -from 63 -to 0 corr_data_3_2
create_bd_pin -dir O -from 63 -to 0 corr_data_4_2
create_bd_pin -dir O -from 63 -to 0 corr_data_5_2
create_bd_pin -dir O -from 63 -to 0 corr_data_6_2
create_bd_pin -dir O -from 63 -to 0 corr_data_7_2
create_bd_pin -dir O -from 63 -to 0 corr_data_8_2
create_bd_pin -dir O -from 63 -to 0 corr_data_9_2
create_bd_pin -dir O -from 63 -to 0 corr_data_10_2
create_bd_pin -dir O -from 63 -to 0 corr_data_11_2
create_bd_pin -dir O -from 63 -to 0 corr_data_12_2
create_bd_pin -dir O -from 63 -to 0 corr_data_13_2
create_bd_pin -dir O -from 63 -to 0 corr_data_14_2
create_bd_pin -dir O -from 63 -to 0 corr_data_15_2
create_bd_pin -dir O -from 63 -to 0 corr_data_0_3
create_bd_pin -dir O -from 63 -to 0 corr_data_1_3
create_bd_pin -dir O -from 63 -to 0 corr_data_2_3
create_bd_pin -dir O -from 63 -to 0 corr_data_3_3
create_bd_pin -dir O -from 63 -to 0 corr_data_4_3
create_bd_pin -dir O -from 63 -to 0 corr_data_5_3
create_bd_pin -dir O -from 63 -to 0 corr_data_6_3
create_bd_pin -dir O -from 63 -to 0 corr_data_7_3
create_bd_pin -dir O -from 63 -to 0 corr_data_8_3
create_bd_pin -dir O -from 63 -to 0 corr_data_9_3
create_bd_pin -dir O -from 63 -to 0 corr_data_10_3
create_bd_pin -dir O -from 63 -to 0 corr_data_11_3
create_bd_pin -dir O -from 63 -to 0 corr_data_12_3
create_bd_pin -dir O -from 63 -to 0 corr_data_13_3
create_bd_pin -dir O -from 63 -to 0 corr_data_14_3
create_bd_pin -dir O -from 63 -to 0 corr_data_15_3
create_bd_pin -dir O -from 63 -to 0 corr_data_0_4
create_bd_pin -dir O -from 63 -to 0 corr_data_1_4
create_bd_pin -dir O -from 63 -to 0 corr_data_2_4
create_bd_pin -dir O -from 63 -to 0 corr_data_3_4
create_bd_pin -dir O -from 63 -to 0 corr_data_4_4
create_bd_pin -dir O -from 63 -to 0 corr_data_5_4
create_bd_pin -dir O -from 63 -to 0 corr_data_6_4
create_bd_pin -dir O -from 63 -to 0 corr_data_7_4
create_bd_pin -dir O -from 63 -to 0 corr_data_8_4
create_bd_pin -dir O -from 63 -to 0 corr_data_9_4
create_bd_pin -dir O -from 63 -to 0 corr_data_10_4
create_bd_pin -dir O -from 63 -to 0 corr_data_11_4
create_bd_pin -dir O -from 63 -to 0 corr_data_12_4
create_bd_pin -dir O -from 63 -to 0 corr_data_13_4
create_bd_pin -dir O -from 63 -to 0 corr_data_14_4
create_bd_pin -dir O -from 63 -to 0 corr_data_15_4
create_bd_pin -dir O -from 63 -to 0 corr_data_0_5
create_bd_pin -dir O -from 63 -to 0 corr_data_1_5
create_bd_pin -dir O -from 63 -to 0 corr_data_2_5
create_bd_pin -dir O -from 63 -to 0 corr_data_3_5
create_bd_pin -dir O -from 63 -to 0 corr_data_4_5
create_bd_pin -dir O -from 63 -to 0 corr_data_5_5
create_bd_pin -dir O -from 63 -to 0 corr_data_6_5
create_bd_pin -dir O -from 63 -to 0 corr_data_7_5
create_bd_pin -dir O -from 63 -to 0 corr_data_8_5
create_bd_pin -dir O -from 63 -to 0 corr_data_9_5
create_bd_pin -dir O -from 63 -to 0 corr_data_10_5
create_bd_pin -dir O -from 63 -to 0 corr_data_11_5
create_bd_pin -dir O -from 63 -to 0 corr_data_12_5
create_bd_pin -dir O -from 63 -to 0 corr_data_13_5
create_bd_pin -dir O -from 63 -to 0 corr_data_14_5
create_bd_pin -dir O -from 63 -to 0 corr_data_15_5
create_bd_pin -dir O -from 63 -to 0 corr_data_0_6
create_bd_pin -dir O -from 63 -to 0 corr_data_1_6
create_bd_pin -dir O -from 63 -to 0 corr_data_2_6
create_bd_pin -dir O -from 63 -to 0 corr_data_3_6
create_bd_pin -dir O -from 63 -to 0 corr_data_4_6
create_bd_pin -dir O -from 63 -to 0 corr_data_5_6
create_bd_pin -dir O -from 63 -to 0 corr_data_6_6
create_bd_pin -dir O -from 63 -to 0 corr_data_7_6
create_bd_pin -dir O -from 63 -to 0 corr_data_8_6
create_bd_pin -dir O -from 63 -to 0 corr_data_9_6
create_bd_pin -dir O -from 63 -to 0 corr_data_10_6
create_bd_pin -dir O -from 63 -to 0 corr_data_11_6
create_bd_pin -dir O -from 63 -to 0 corr_data_12_6
create_bd_pin -dir O -from 63 -to 0 corr_data_13_6
create_bd_pin -dir O -from 63 -to 0 corr_data_14_6
create_bd_pin -dir O -from 63 -to 0 corr_data_15_6
create_bd_pin -dir O -from 63 -to 0 corr_data_0_7
create_bd_pin -dir O -from 63 -to 0 corr_data_1_7
create_bd_pin -dir O -from 63 -to 0 corr_data_2_7
create_bd_pin -dir O -from 63 -to 0 corr_data_3_7
create_bd_pin -dir O -from 63 -to 0 corr_data_4_7
create_bd_pin -dir O -from 63 -to 0 corr_data_5_7
create_bd_pin -dir O -from 63 -to 0 corr_data_6_7
create_bd_pin -dir O -from 63 -to 0 corr_data_7_7
create_bd_pin -dir O -from 63 -to 0 corr_data_8_7
create_bd_pin -dir O -from 63 -to 0 corr_data_9_7
create_bd_pin -dir O -from 63 -to 0 corr_data_10_7
create_bd_pin -dir O -from 63 -to 0 corr_data_11_7
create_bd_pin -dir O -from 63 -to 0 corr_data_12_7
create_bd_pin -dir O -from 63 -to 0 corr_data_13_7
create_bd_pin -dir O -from 63 -to 0 corr_data_14_7
create_bd_pin -dir O -from 63 -to 0 corr_data_15_7
create_bd_pin -dir O -from 1 -to 0 corr_valid
create_bd_pin -dir O -from 1 -to 0 corr_valid1
create_bd_pin -dir O -from 1 -to 0 corr_valid2
create_bd_pin -dir O -from 1 -to 0 corr_valid3
create_bd_pin -dir O -from 1 -to 0 corr_valid4
create_bd_pin -dir O -from 1 -to 0 corr_valid5
create_bd_pin -dir O -from 1 -to 0 corr_valid6
create_bd_pin -dir O -from 1 -to 0 corr_valid7
create_bd_pin -dir O comm_rden
create_bd_pin -dir O -from 13 -to 0 comm_addr
create_bd_pin -dir I demap_done
create_bd_pin -dir I aveg_done

create_bd_cell -type module -reference Correlation Correlation_0
set_property -dict {CONFIG.PARA 16} [get_bd_cells Correlation_0]
create_bd_cell -type module -reference Correlation Correlation_1
set_property -dict {CONFIG.PARA 16} [get_bd_cells Correlation_1]
create_bd_cell -type module -reference Correlation Correlation_2
set_property -dict {CONFIG.PARA 16} [get_bd_cells Correlation_2]
create_bd_cell -type module -reference Correlation Correlation_3
set_property -dict {CONFIG.PARA 16} [get_bd_cells Correlation_3]
create_bd_cell -type module -reference Correlation Correlation_4
set_property -dict {CONFIG.PARA 16} [get_bd_cells Correlation_4]
create_bd_cell -type module -reference Correlation Correlation_5
set_property -dict {CONFIG.PARA 16} [get_bd_cells Correlation_5]
create_bd_cell -type module -reference Correlation Correlation_6
set_property -dict {CONFIG.PARA 16} [get_bd_cells Correlation_6]
create_bd_cell -type module -reference Correlation Correlation_7
set_property -dict {CONFIG.PARA 16} [get_bd_cells Correlation_7]

# ---- hierarchy /Average ----
current_bd_instance /Average
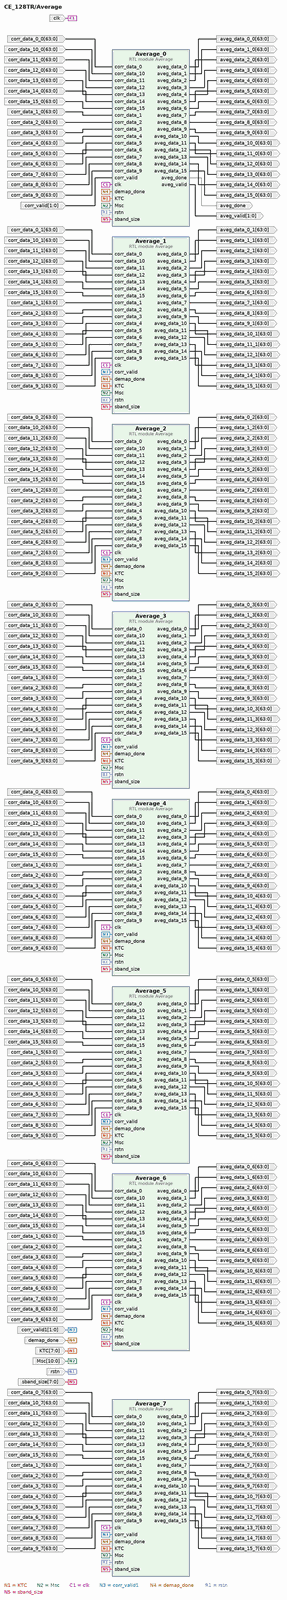
[diagram p14: block diagram inside /Average, whole]
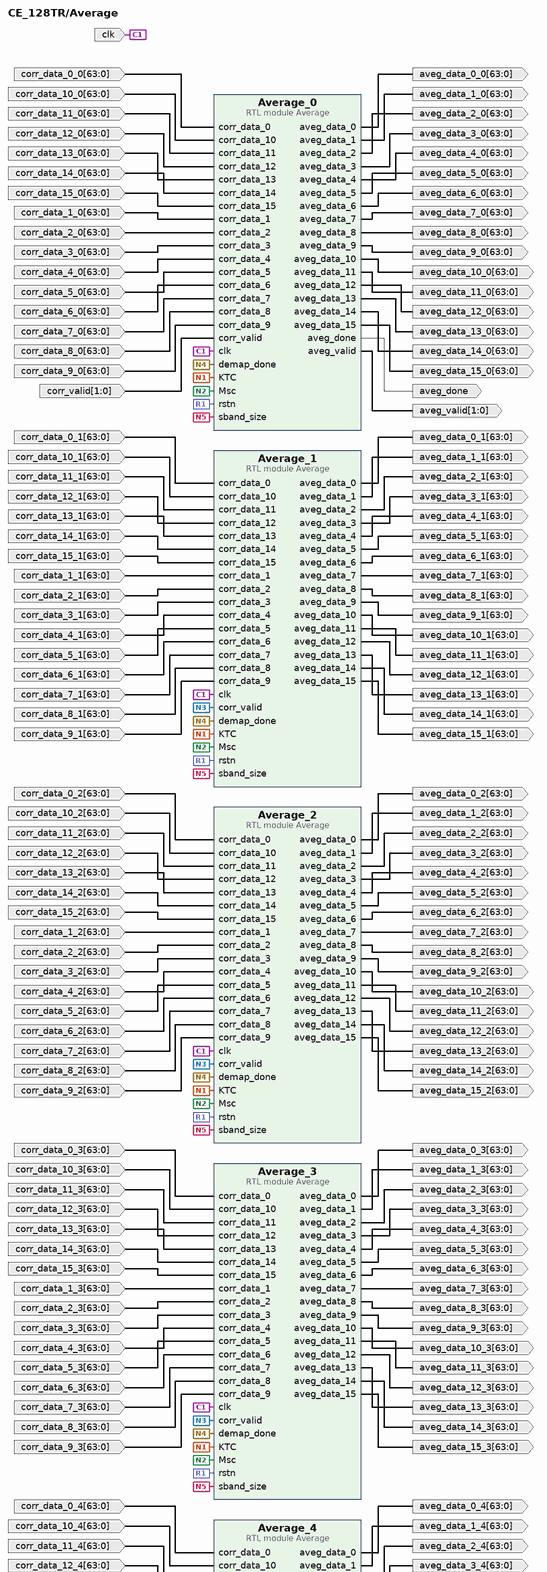
[diagram p15: block diagram inside /Average, upper part]
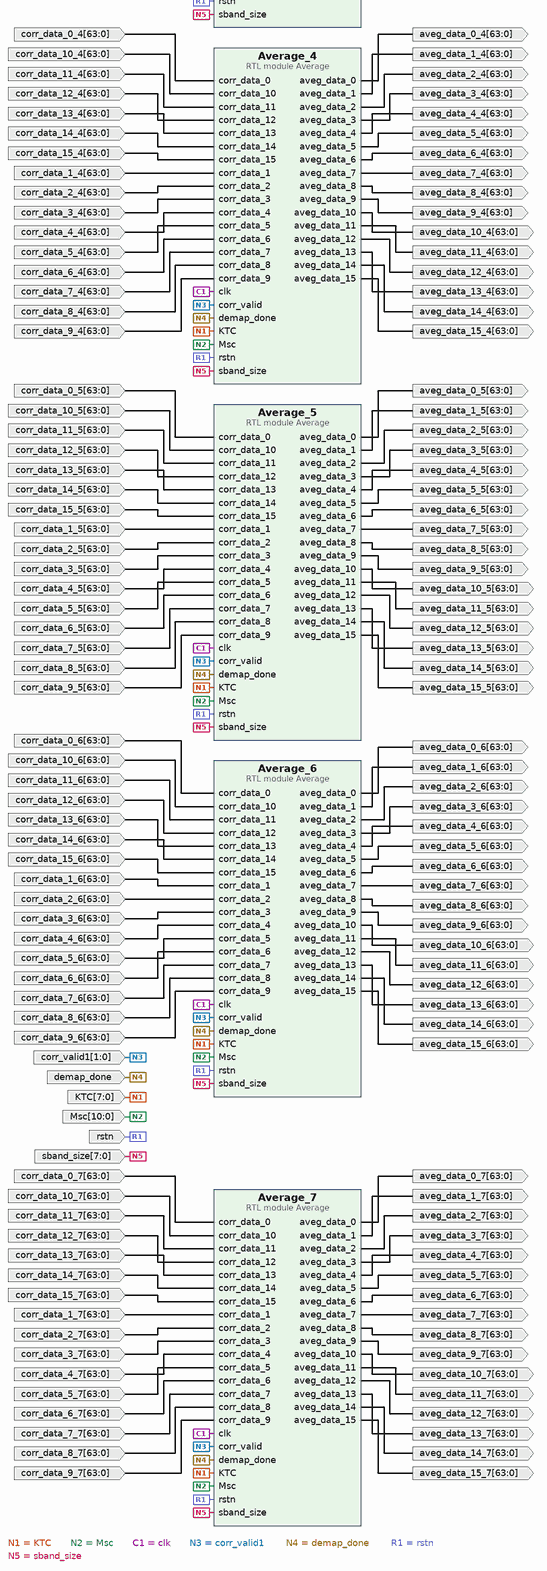
[diagram p16: block diagram inside /Average, lower part]
create_bd_pin -dir I clk
create_bd_pin -dir I rstn
create_bd_pin -dir I demap_done
create_bd_pin -dir I -from 7 -to 0 sband_size
create_bd_pin -dir I -from 7 -to 0 KTC
create_bd_pin -dir I -from 10 -to 0 Msc
create_bd_pin -dir I -from 1 -to 0 corr_valid
create_bd_pin -dir I -from 63 -to 0 corr_data_0_0
create_bd_pin -dir I -from 63 -to 0 corr_data_1_0
create_bd_pin -dir I -from 63 -to 0 corr_data_2_0
create_bd_pin -dir I -from 63 -to 0 corr_data_3_0
create_bd_pin -dir I -from 63 -to 0 corr_data_4_0
create_bd_pin -dir I -from 63 -to 0 corr_data_5_0
create_bd_pin -dir I -from 63 -to 0 corr_data_6_0
create_bd_pin -dir I -from 63 -to 0 corr_data_7_0
create_bd_pin -dir I -from 63 -to 0 corr_data_8_0
create_bd_pin -dir I -from 63 -to 0 corr_data_9_0
create_bd_pin -dir I -from 63 -to 0 corr_data_10_0
create_bd_pin -dir I -from 63 -to 0 corr_data_11_0
create_bd_pin -dir I -from 63 -to 0 corr_data_12_0
create_bd_pin -dir I -from 63 -to 0 corr_data_13_0
create_bd_pin -dir I -from 63 -to 0 corr_data_14_0
create_bd_pin -dir I -from 63 -to 0 corr_data_15_0
create_bd_pin -dir I -from 63 -to 0 corr_data_0_1
create_bd_pin -dir I -from 63 -to 0 corr_data_1_1
create_bd_pin -dir I -from 63 -to 0 corr_data_2_1
create_bd_pin -dir I -from 63 -to 0 corr_data_3_1
create_bd_pin -dir I -from 63 -to 0 corr_data_4_1
create_bd_pin -dir I -from 63 -to 0 corr_data_5_1
create_bd_pin -dir I -from 63 -to 0 corr_data_6_1
create_bd_pin -dir I -from 63 -to 0 corr_data_7_1
create_bd_pin -dir I -from 63 -to 0 corr_data_8_1
create_bd_pin -dir I -from 63 -to 0 corr_data_9_1
create_bd_pin -dir I -from 63 -to 0 corr_data_10_1
create_bd_pin -dir I -from 63 -to 0 corr_data_11_1
create_bd_pin -dir I -from 63 -to 0 corr_data_12_1
create_bd_pin -dir I -from 63 -to 0 corr_data_13_1
create_bd_pin -dir I -from 63 -to 0 corr_data_14_1
create_bd_pin -dir I -from 63 -to 0 corr_data_15_1
create_bd_pin -dir I -from 63 -to 0 corr_data_0_2
create_bd_pin -dir I -from 63 -to 0 corr_data_1_2
create_bd_pin -dir I -from 63 -to 0 corr_data_2_2
create_bd_pin -dir I -from 63 -to 0 corr_data_3_2
create_bd_pin -dir I -from 63 -to 0 corr_data_4_2
create_bd_pin -dir I -from 63 -to 0 corr_data_5_2
create_bd_pin -dir I -from 63 -to 0 corr_data_6_2
create_bd_pin -dir I -from 63 -to 0 corr_data_7_2
create_bd_pin -dir I -from 63 -to 0 corr_data_8_2
create_bd_pin -dir I -from 63 -to 0 corr_data_9_2
create_bd_pin -dir I -from 63 -to 0 corr_data_10_2
create_bd_pin -dir I -from 63 -to 0 corr_data_11_2
create_bd_pin -dir I -from 63 -to 0 corr_data_12_2
create_bd_pin -dir I -from 63 -to 0 corr_data_13_2
create_bd_pin -dir I -from 63 -to 0 corr_data_14_2
create_bd_pin -dir I -from 63 -to 0 corr_data_15_2
create_bd_pin -dir I -from 63 -to 0 corr_data_0_3
create_bd_pin -dir I -from 63 -to 0 corr_data_1_3
create_bd_pin -dir I -from 63 -to 0 corr_data_2_3
create_bd_pin -dir I -from 63 -to 0 corr_data_3_3
create_bd_pin -dir I -from 63 -to 0 corr_data_4_3
create_bd_pin -dir I -from 63 -to 0 corr_data_5_3
create_bd_pin -dir I -from 63 -to 0 corr_data_6_3
create_bd_pin -dir I -from 63 -to 0 corr_data_7_3
create_bd_pin -dir I -from 63 -to 0 corr_data_8_3
create_bd_pin -dir I -from 63 -to 0 corr_data_9_3
create_bd_pin -dir I -from 63 -to 0 corr_data_10_3
create_bd_pin -dir I -from 63 -to 0 corr_data_11_3
create_bd_pin -dir I -from 63 -to 0 corr_data_12_3
create_bd_pin -dir I -from 63 -to 0 corr_data_13_3
create_bd_pin -dir I -from 63 -to 0 corr_data_14_3
create_bd_pin -dir I -from 63 -to 0 corr_data_15_3
create_bd_pin -dir I -from 63 -to 0 corr_data_0_4
create_bd_pin -dir I -from 63 -to 0 corr_data_1_4
create_bd_pin -dir I -from 63 -to 0 corr_data_2_4
create_bd_pin -dir I -from 63 -to 0 corr_data_3_4
create_bd_pin -dir I -from 63 -to 0 corr_data_4_4
create_bd_pin -dir I -from 63 -to 0 corr_data_5_4
create_bd_pin -dir I -from 63 -to 0 corr_data_6_4
create_bd_pin -dir I -from 63 -to 0 corr_data_7_4
create_bd_pin -dir I -from 63 -to 0 corr_data_8_4
create_bd_pin -dir I -from 63 -to 0 corr_data_9_4
create_bd_pin -dir I -from 63 -to 0 corr_data_10_4
create_bd_pin -dir I -from 63 -to 0 corr_data_11_4
create_bd_pin -dir I -from 63 -to 0 corr_data_12_4
create_bd_pin -dir I -from 63 -to 0 corr_data_13_4
create_bd_pin -dir I -from 63 -to 0 corr_data_14_4
create_bd_pin -dir I -from 63 -to 0 corr_data_15_4
create_bd_pin -dir I -from 63 -to 0 corr_data_0_5
create_bd_pin -dir I -from 63 -to 0 corr_data_1_5
create_bd_pin -dir I -from 63 -to 0 corr_data_2_5
create_bd_pin -dir I -from 63 -to 0 corr_data_3_5
create_bd_pin -dir I -from 63 -to 0 corr_data_4_5
create_bd_pin -dir I -from 63 -to 0 corr_data_5_5
create_bd_pin -dir I -from 63 -to 0 corr_data_6_5
create_bd_pin -dir I -from 63 -to 0 corr_data_7_5
create_bd_pin -dir I -from 63 -to 0 corr_data_8_5
create_bd_pin -dir I -from 63 -to 0 corr_data_9_5
create_bd_pin -dir I -from 63 -to 0 corr_data_10_5
create_bd_pin -dir I -from 63 -to 0 corr_data_11_5
create_bd_pin -dir I -from 63 -to 0 corr_data_12_5
create_bd_pin -dir I -from 63 -to 0 corr_data_13_5
create_bd_pin -dir I -from 63 -to 0 corr_data_14_5
create_bd_pin -dir I -from 63 -to 0 corr_data_15_5
create_bd_pin -dir I -from 63 -to 0 corr_data_0_6
create_bd_pin -dir I -from 63 -to 0 corr_data_1_6
create_bd_pin -dir I -from 63 -to 0 corr_data_2_6
create_bd_pin -dir I -from 63 -to 0 corr_data_3_6
create_bd_pin -dir I -from 63 -to 0 corr_data_4_6
create_bd_pin -dir I -from 63 -to 0 corr_data_5_6
create_bd_pin -dir I -from 63 -to 0 corr_data_6_6
create_bd_pin -dir I -from 63 -to 0 corr_data_7_6
create_bd_pin -dir I -from 63 -to 0 corr_data_8_6
create_bd_pin -dir I -from 63 -to 0 corr_data_9_6
create_bd_pin -dir I -from 63 -to 0 corr_data_10_6
create_bd_pin -dir I -from 63 -to 0 corr_data_11_6
create_bd_pin -dir I -from 63 -to 0 corr_data_12_6
create_bd_pin -dir I -from 63 -to 0 corr_data_13_6
create_bd_pin -dir I -from 63 -to 0 corr_data_14_6
create_bd_pin -dir I -from 63 -to 0 corr_data_15_6
create_bd_pin -dir I -from 63 -to 0 corr_data_0_7
create_bd_pin -dir I -from 63 -to 0 corr_data_1_7
create_bd_pin -dir I -from 63 -to 0 corr_data_2_7
create_bd_pin -dir I -from 63 -to 0 corr_data_3_7
create_bd_pin -dir I -from 63 -to 0 corr_data_4_7
create_bd_pin -dir I -from 63 -to 0 corr_data_5_7
create_bd_pin -dir I -from 63 -to 0 corr_data_6_7
create_bd_pin -dir I -from 63 -to 0 corr_data_7_7
create_bd_pin -dir I -from 63 -to 0 corr_data_8_7
create_bd_pin -dir I -from 63 -to 0 corr_data_9_7
create_bd_pin -dir I -from 63 -to 0 corr_data_10_7
create_bd_pin -dir I -from 63 -to 0 corr_data_11_7
create_bd_pin -dir I -from 63 -to 0 corr_data_12_7
create_bd_pin -dir I -from 63 -to 0 corr_data_13_7
create_bd_pin -dir I -from 63 -to 0 corr_data_14_7
create_bd_pin -dir I -from 63 -to 0 corr_data_15_7
create_bd_pin -dir O -from 1 -to 0 aveg_valid
create_bd_pin -dir O -from 63 -to 0 aveg_data_0_0
create_bd_pin -dir O -from 63 -to 0 aveg_data_1_0
create_bd_pin -dir O -from 63 -to 0 aveg_data_2_0
create_bd_pin -dir O -from 63 -to 0 aveg_data_3_0
create_bd_pin -dir O -from 63 -to 0 aveg_data_4_0
create_bd_pin -dir O -from 63 -to 0 aveg_data_5_0
create_bd_pin -dir O -from 63 -to 0 aveg_data_6_0
create_bd_pin -dir O -from 63 -to 0 aveg_data_7_0
create_bd_pin -dir O -from 63 -to 0 aveg_data_8_0
create_bd_pin -dir O -from 63 -to 0 aveg_data_9_0
create_bd_pin -dir O -from 63 -to 0 aveg_data_10_0
create_bd_pin -dir O -from 63 -to 0 aveg_data_11_0
create_bd_pin -dir O -from 63 -to 0 aveg_data_12_0
create_bd_pin -dir O -from 63 -to 0 aveg_data_13_0
create_bd_pin -dir O -from 63 -to 0 aveg_data_14_0
create_bd_pin -dir O -from 63 -to 0 aveg_data_15_0
create_bd_pin -dir O -from 63 -to 0 aveg_data_0_1
create_bd_pin -dir O -from 63 -to 0 aveg_data_1_1
create_bd_pin -dir O -from 63 -to 0 aveg_data_2_1
create_bd_pin -dir O -from 63 -to 0 aveg_data_3_1
create_bd_pin -dir O -from 63 -to 0 aveg_data_4_1
create_bd_pin -dir O -from 63 -to 0 aveg_data_5_1
create_bd_pin -dir O -from 63 -to 0 aveg_data_6_1
create_bd_pin -dir O -from 63 -to 0 aveg_data_7_1
create_bd_pin -dir O -from 63 -to 0 aveg_data_8_1
create_bd_pin -dir O -from 63 -to 0 aveg_data_9_1
create_bd_pin -dir O -from 63 -to 0 aveg_data_10_1
create_bd_pin -dir O -from 63 -to 0 aveg_data_11_1
create_bd_pin -dir O -from 63 -to 0 aveg_data_12_1
create_bd_pin -dir O -from 63 -to 0 aveg_data_13_1
create_bd_pin -dir O -from 63 -to 0 aveg_data_14_1
create_bd_pin -dir O -from 63 -to 0 aveg_data_15_1
create_bd_pin -dir O -from 63 -to 0 aveg_data_0_2
create_bd_pin -dir O -from 63 -to 0 aveg_data_1_2
create_bd_pin -dir O -from 63 -to 0 aveg_data_2_2
create_bd_pin -dir O -from 63 -to 0 aveg_data_3_2
create_bd_pin -dir O -from 63 -to 0 aveg_data_4_2
create_bd_pin -dir O -from 63 -to 0 aveg_data_5_2
create_bd_pin -dir O -from 63 -to 0 aveg_data_6_2
create_bd_pin -dir O -from 63 -to 0 aveg_data_7_2
create_bd_pin -dir O -from 63 -to 0 aveg_data_8_2
create_bd_pin -dir O -from 63 -to 0 aveg_data_9_2
create_bd_pin -dir O -from 63 -to 0 aveg_data_10_2
create_bd_pin -dir O -from 63 -to 0 aveg_data_11_2
create_bd_pin -dir O -from 63 -to 0 aveg_data_12_2
create_bd_pin -dir O -from 63 -to 0 aveg_data_13_2
create_bd_pin -dir O -from 63 -to 0 aveg_data_14_2
create_bd_pin -dir O -from 63 -to 0 aveg_data_15_2
create_bd_pin -dir O -from 63 -to 0 aveg_data_0_3
create_bd_pin -dir O -from 63 -to 0 aveg_data_1_3
create_bd_pin -dir O -from 63 -to 0 aveg_data_2_3
create_bd_pin -dir O -from 63 -to 0 aveg_data_3_3
create_bd_pin -dir O -from 63 -to 0 aveg_data_4_3
create_bd_pin -dir O -from 63 -to 0 aveg_data_5_3
create_bd_pin -dir O -from 63 -to 0 aveg_data_6_3
create_bd_pin -dir O -from 63 -to 0 aveg_data_7_3
create_bd_pin -dir O -from 63 -to 0 aveg_data_8_3
create_bd_pin -dir O -from 63 -to 0 aveg_data_9_3
create_bd_pin -dir O -from 63 -to 0 aveg_data_10_3
create_bd_pin -dir O -from 63 -to 0 aveg_data_11_3
create_bd_pin -dir O -from 63 -to 0 aveg_data_12_3
create_bd_pin -dir O -from 63 -to 0 aveg_data_13_3
create_bd_pin -dir O -from 63 -to 0 aveg_data_14_3
create_bd_pin -dir O -from 63 -to 0 aveg_data_15_3
create_bd_pin -dir O -from 63 -to 0 aveg_data_0_4
create_bd_pin -dir O -from 63 -to 0 aveg_data_1_4
create_bd_pin -dir O -from 63 -to 0 aveg_data_2_4
create_bd_pin -dir O -from 63 -to 0 aveg_data_3_4
create_bd_pin -dir O -from 63 -to 0 aveg_data_4_4
create_bd_pin -dir O -from 63 -to 0 aveg_data_5_4
create_bd_pin -dir O -from 63 -to 0 aveg_data_6_4
create_bd_pin -dir O -from 63 -to 0 aveg_data_7_4
create_bd_pin -dir O -from 63 -to 0 aveg_data_8_4
create_bd_pin -dir O -from 63 -to 0 aveg_data_9_4
create_bd_pin -dir O -from 63 -to 0 aveg_data_10_4
create_bd_pin -dir O -from 63 -to 0 aveg_data_11_4
create_bd_pin -dir O -from 63 -to 0 aveg_data_12_4
create_bd_pin -dir O -from 63 -to 0 aveg_data_13_4
create_bd_pin -dir O -from 63 -to 0 aveg_data_14_4
create_bd_pin -dir O -from 63 -to 0 aveg_data_15_4
create_bd_pin -dir O -from 63 -to 0 aveg_data_0_5
create_bd_pin -dir O -from 63 -to 0 aveg_data_1_5
create_bd_pin -dir O -from 63 -to 0 aveg_data_2_5
create_bd_pin -dir O -from 63 -to 0 aveg_data_3_5
create_bd_pin -dir O -from 63 -to 0 aveg_data_4_5
create_bd_pin -dir O -from 63 -to 0 aveg_data_5_5
create_bd_pin -dir O -from 63 -to 0 aveg_data_6_5
create_bd_pin -dir O -from 63 -to 0 aveg_data_7_5
create_bd_pin -dir O -from 63 -to 0 aveg_data_8_5
create_bd_pin -dir O -from 63 -to 0 aveg_data_9_5
create_bd_pin -dir O -from 63 -to 0 aveg_data_10_5
create_bd_pin -dir O -from 63 -to 0 aveg_data_11_5
create_bd_pin -dir O -from 63 -to 0 aveg_data_12_5
create_bd_pin -dir O -from 63 -to 0 aveg_data_13_5
create_bd_pin -dir O -from 63 -to 0 aveg_data_14_5
create_bd_pin -dir O -from 63 -to 0 aveg_data_15_5
create_bd_pin -dir O -from 63 -to 0 aveg_data_0_6
create_bd_pin -dir O -from 63 -to 0 aveg_data_1_6
create_bd_pin -dir O -from 63 -to 0 aveg_data_2_6
create_bd_pin -dir O -from 63 -to 0 aveg_data_3_6
create_bd_pin -dir O -from 63 -to 0 aveg_data_4_6
create_bd_pin -dir O -from 63 -to 0 aveg_data_5_6
create_bd_pin -dir O -from 63 -to 0 aveg_data_6_6
create_bd_pin -dir O -from 63 -to 0 aveg_data_7_6
create_bd_pin -dir O -from 63 -to 0 aveg_data_8_6
create_bd_pin -dir O -from 63 -to 0 aveg_data_9_6
create_bd_pin -dir O -from 63 -to 0 aveg_data_10_6
create_bd_pin -dir O -from 63 -to 0 aveg_data_11_6
create_bd_pin -dir O -from 63 -to 0 aveg_data_12_6
create_bd_pin -dir O -from 63 -to 0 aveg_data_13_6
create_bd_pin -dir O -from 63 -to 0 aveg_data_14_6
create_bd_pin -dir O -from 63 -to 0 aveg_data_15_6
create_bd_pin -dir O -from 63 -to 0 aveg_data_0_7
create_bd_pin -dir O -from 63 -to 0 aveg_data_1_7
create_bd_pin -dir O -from 63 -to 0 aveg_data_2_7
create_bd_pin -dir O -from 63 -to 0 aveg_data_3_7
create_bd_pin -dir O -from 63 -to 0 aveg_data_4_7
create_bd_pin -dir O -from 63 -to 0 aveg_data_5_7
create_bd_pin -dir O -from 63 -to 0 aveg_data_6_7
create_bd_pin -dir O -from 63 -to 0 aveg_data_7_7
create_bd_pin -dir O -from 63 -to 0 aveg_data_8_7
create_bd_pin -dir O -from 63 -to 0 aveg_data_9_7
create_bd_pin -dir O -from 63 -to 0 aveg_data_10_7
create_bd_pin -dir O -from 63 -to 0 aveg_data_11_7
create_bd_pin -dir O -from 63 -to 0 aveg_data_12_7
create_bd_pin -dir O -from 63 -to 0 aveg_data_13_7
create_bd_pin -dir O -from 63 -to 0 aveg_data_14_7
create_bd_pin -dir O -from 63 -to 0 aveg_data_15_7
create_bd_pin -dir O aveg_done
create_bd_pin -dir I -from 1 -to 0 corr_valid1

create_bd_cell -type module -reference Average Average_1
create_bd_cell -type module -reference Average Average_2
create_bd_cell -type module -reference Average Average_3
create_bd_cell -type module -reference Average Average_4
create_bd_cell -type module -reference Average Average_5
create_bd_cell -type module -reference Average Average_6
create_bd_cell -type module -reference Average Average_7
create_bd_cell -type module -reference Average Average_0

# ---- hierarchy /EstNoise ----
current_bd_instance /EstNoise
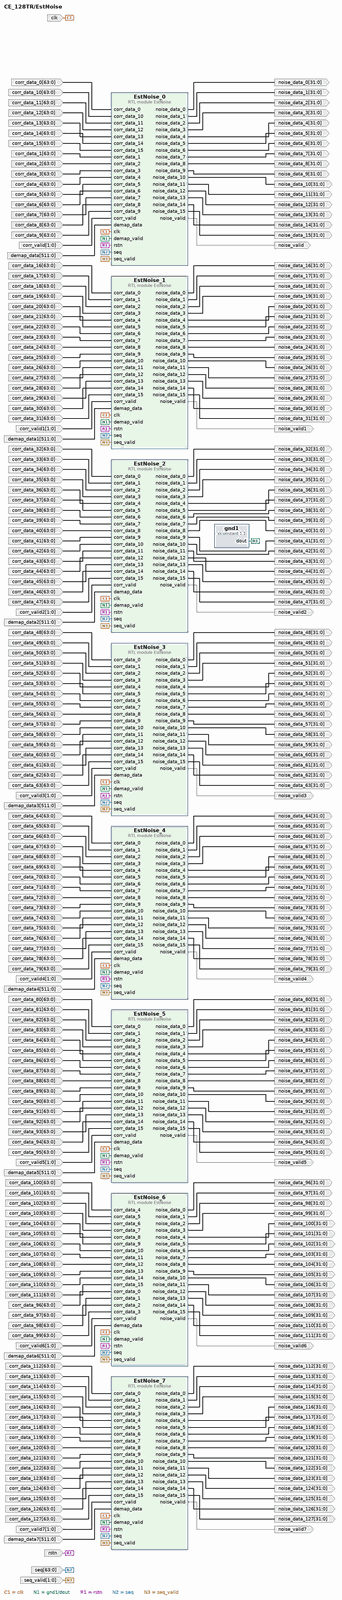
[diagram p17: block diagram inside /EstNoise, whole]
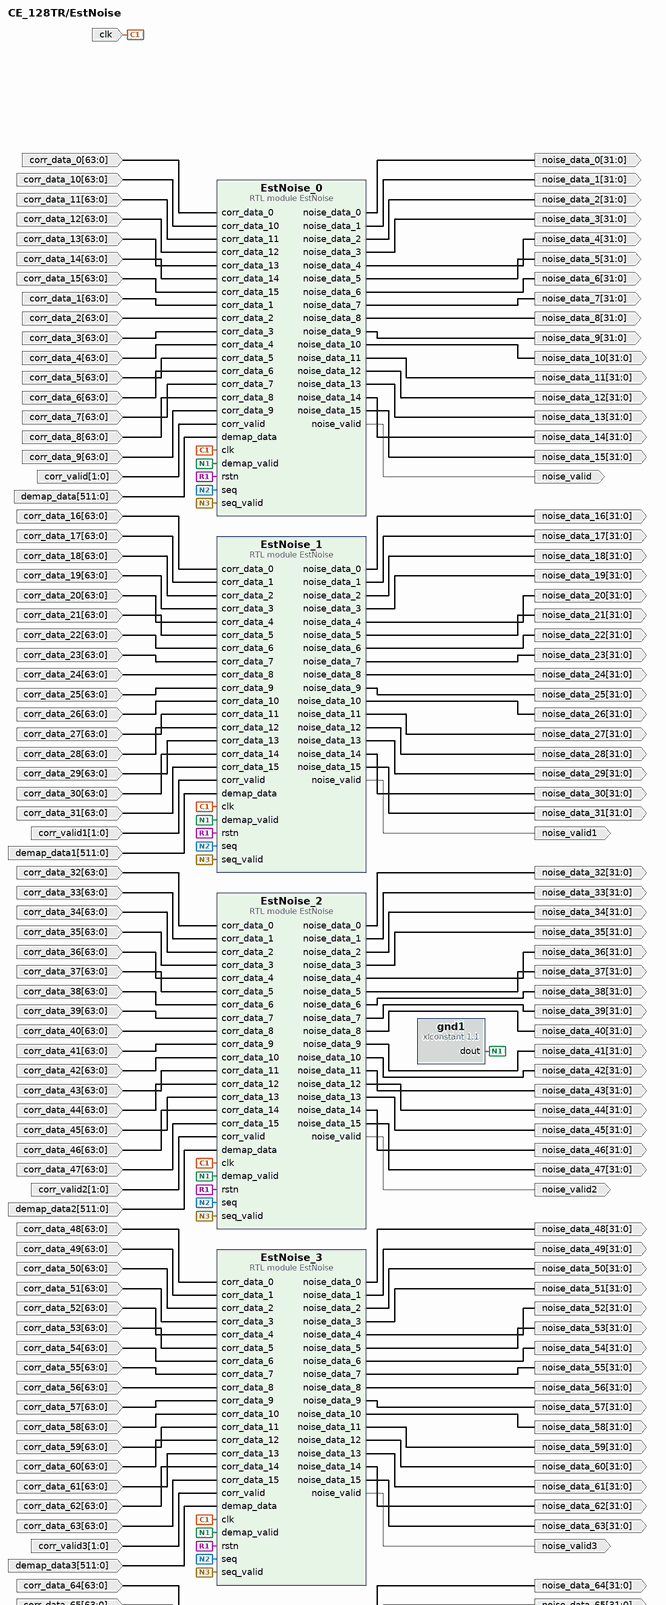
[diagram p18: block diagram inside /EstNoise, upper part]
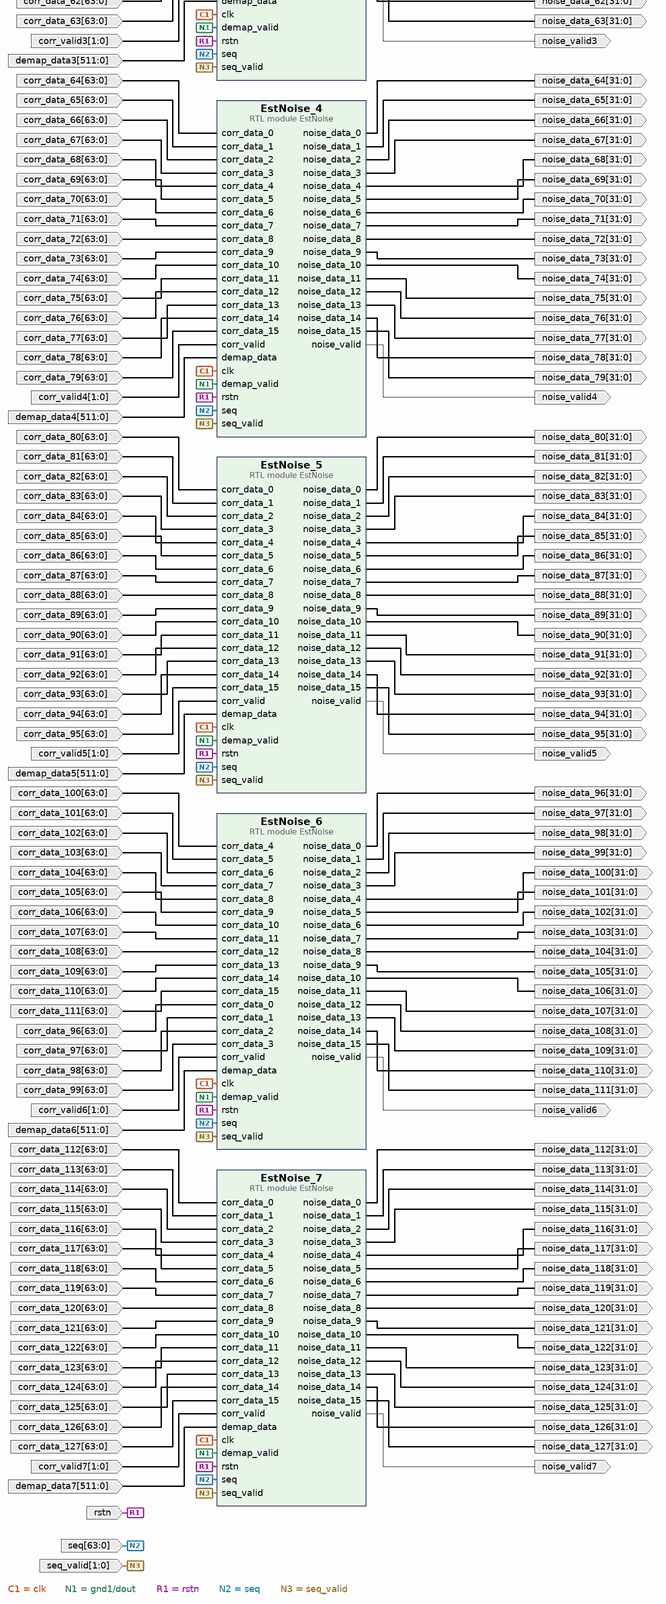
[diagram p19: block diagram inside /EstNoise, lower part]
create_bd_pin -dir I -type clk clk
create_bd_pin -dir I -type rst rstn
create_bd_pin -dir I -from 63 -to 0 seq
create_bd_pin -dir I -from 1 -to 0 seq_valid
create_bd_pin -dir I -from 511 -to 0 demap_data
create_bd_pin -dir I -from 1 -to 0 corr_valid
create_bd_pin -dir I -from 63 -to 0 corr_data_0
create_bd_pin -dir I -from 63 -to 0 corr_data_1
create_bd_pin -dir I -from 63 -to 0 corr_data_2
create_bd_pin -dir I -from 63 -to 0 corr_data_3
create_bd_pin -dir I -from 63 -to 0 corr_data_4
create_bd_pin -dir I -from 63 -to 0 corr_data_5
create_bd_pin -dir I -from 63 -to 0 corr_data_6
create_bd_pin -dir I -from 63 -to 0 corr_data_7
create_bd_pin -dir I -from 63 -to 0 corr_data_8
create_bd_pin -dir I -from 63 -to 0 corr_data_9
create_bd_pin -dir I -from 63 -to 0 corr_data_10
create_bd_pin -dir I -from 63 -to 0 corr_data_11
create_bd_pin -dir I -from 63 -to 0 corr_data_12
create_bd_pin -dir I -from 63 -to 0 corr_data_13
create_bd_pin -dir I -from 63 -to 0 corr_data_14
create_bd_pin -dir I -from 63 -to 0 corr_data_15
create_bd_pin -dir I -from 511 -to 0 demap_data1
create_bd_pin -dir I -from 1 -to 0 corr_valid1
create_bd_pin -dir I -from 63 -to 0 corr_data_16
create_bd_pin -dir I -from 63 -to 0 corr_data_17
create_bd_pin -dir I -from 63 -to 0 corr_data_18
create_bd_pin -dir I -from 63 -to 0 corr_data_19
create_bd_pin -dir I -from 63 -to 0 corr_data_20
create_bd_pin -dir I -from 63 -to 0 corr_data_21
create_bd_pin -dir I -from 63 -to 0 corr_data_22
create_bd_pin -dir I -from 63 -to 0 corr_data_23
create_bd_pin -dir I -from 63 -to 0 corr_data_24
create_bd_pin -dir I -from 63 -to 0 corr_data_25
create_bd_pin -dir I -from 63 -to 0 corr_data_26
create_bd_pin -dir I -from 63 -to 0 corr_data_27
create_bd_pin -dir I -from 63 -to 0 corr_data_28
create_bd_pin -dir I -from 63 -to 0 corr_data_29
create_bd_pin -dir I -from 63 -to 0 corr_data_30
create_bd_pin -dir I -from 63 -to 0 corr_data_31
create_bd_pin -dir I -from 511 -to 0 demap_data2
create_bd_pin -dir I -from 1 -to 0 corr_valid2
create_bd_pin -dir I -from 63 -to 0 corr_data_32
create_bd_pin -dir I -from 63 -to 0 corr_data_33
create_bd_pin -dir I -from 63 -to 0 corr_data_34
create_bd_pin -dir I -from 63 -to 0 corr_data_35
create_bd_pin -dir I -from 63 -to 0 corr_data_36
create_bd_pin -dir I -from 63 -to 0 corr_data_37
create_bd_pin -dir I -from 63 -to 0 corr_data_38
create_bd_pin -dir I -from 63 -to 0 corr_data_39
create_bd_pin -dir I -from 63 -to 0 corr_data_40
create_bd_pin -dir I -from 63 -to 0 corr_data_41
create_bd_pin -dir I -from 63 -to 0 corr_data_42
create_bd_pin -dir I -from 63 -to 0 corr_data_43
create_bd_pin -dir I -from 63 -to 0 corr_data_44
create_bd_pin -dir I -from 63 -to 0 corr_data_45
create_bd_pin -dir I -from 63 -to 0 corr_data_46
create_bd_pin -dir I -from 63 -to 0 corr_data_47
create_bd_pin -dir I -from 511 -to 0 demap_data3
create_bd_pin -dir I -from 1 -to 0 corr_valid3
create_bd_pin -dir I -from 63 -to 0 corr_data_48
create_bd_pin -dir I -from 63 -to 0 corr_data_49
create_bd_pin -dir I -from 63 -to 0 corr_data_50
create_bd_pin -dir I -from 63 -to 0 corr_data_51
create_bd_pin -dir I -from 63 -to 0 corr_data_52
create_bd_pin -dir I -from 63 -to 0 corr_data_53
create_bd_pin -dir I -from 63 -to 0 corr_data_54
create_bd_pin -dir I -from 63 -to 0 corr_data_55
create_bd_pin -dir I -from 63 -to 0 corr_data_56
create_bd_pin -dir I -from 63 -to 0 corr_data_57
create_bd_pin -dir I -from 63 -to 0 corr_data_58
create_bd_pin -dir I -from 63 -to 0 corr_data_59
create_bd_pin -dir I -from 63 -to 0 corr_data_60
create_bd_pin -dir I -from 63 -to 0 corr_data_61
create_bd_pin -dir I -from 63 -to 0 corr_data_62
create_bd_pin -dir I -from 63 -to 0 corr_data_63
create_bd_pin -dir I -from 511 -to 0 demap_data4
create_bd_pin -dir I -from 1 -to 0 corr_valid4
create_bd_pin -dir I -from 63 -to 0 corr_data_64
create_bd_pin -dir I -from 63 -to 0 corr_data_65
create_bd_pin -dir I -from 63 -to 0 corr_data_66
create_bd_pin -dir I -from 63 -to 0 corr_data_67
create_bd_pin -dir I -from 63 -to 0 corr_data_68
create_bd_pin -dir I -from 63 -to 0 corr_data_69
create_bd_pin -dir I -from 63 -to 0 corr_data_70
create_bd_pin -dir I -from 63 -to 0 corr_data_71
create_bd_pin -dir I -from 63 -to 0 corr_data_72
create_bd_pin -dir I -from 63 -to 0 corr_data_73
create_bd_pin -dir I -from 63 -to 0 corr_data_74
create_bd_pin -dir I -from 63 -to 0 corr_data_75
create_bd_pin -dir I -from 63 -to 0 corr_data_76
create_bd_pin -dir I -from 63 -to 0 corr_data_77
create_bd_pin -dir I -from 63 -to 0 corr_data_78
create_bd_pin -dir I -from 63 -to 0 corr_data_79
create_bd_pin -dir I -from 511 -to 0 demap_data5
create_bd_pin -dir I -from 1 -to 0 corr_valid5
create_bd_pin -dir I -from 63 -to 0 corr_data_80
create_bd_pin -dir I -from 63 -to 0 corr_data_81
create_bd_pin -dir I -from 63 -to 0 corr_data_82
create_bd_pin -dir I -from 63 -to 0 corr_data_83
create_bd_pin -dir I -from 63 -to 0 corr_data_84
create_bd_pin -dir I -from 63 -to 0 corr_data_85
create_bd_pin -dir I -from 63 -to 0 corr_data_86
create_bd_pin -dir I -from 63 -to 0 corr_data_87
create_bd_pin -dir I -from 63 -to 0 corr_data_88
create_bd_pin -dir I -from 63 -to 0 corr_data_89
create_bd_pin -dir I -from 63 -to 0 corr_data_90
create_bd_pin -dir I -from 63 -to 0 corr_data_91
create_bd_pin -dir I -from 63 -to 0 corr_data_92
create_bd_pin -dir I -from 63 -to 0 corr_data_93
create_bd_pin -dir I -from 63 -to 0 corr_data_94
create_bd_pin -dir I -from 63 -to 0 corr_data_95
create_bd_pin -dir I -from 511 -to 0 demap_data6
create_bd_pin -dir I -from 1 -to 0 corr_valid6
create_bd_pin -dir I -from 63 -to 0 corr_data_96
create_bd_pin -dir I -from 63 -to 0 corr_data_97
create_bd_pin -dir I -from 63 -to 0 corr_data_98
create_bd_pin -dir I -from 63 -to 0 corr_data_99
create_bd_pin -dir I -from 63 -to 0 corr_data_100
create_bd_pin -dir I -from 63 -to 0 corr_data_101
create_bd_pin -dir I -from 63 -to 0 corr_data_102
create_bd_pin -dir I -from 63 -to 0 corr_data_103
create_bd_pin -dir I -from 63 -to 0 corr_data_104
create_bd_pin -dir I -from 63 -to 0 corr_data_105
create_bd_pin -dir I -from 63 -to 0 corr_data_106
create_bd_pin -dir I -from 63 -to 0 corr_data_107
create_bd_pin -dir I -from 63 -to 0 corr_data_108
create_bd_pin -dir I -from 63 -to 0 corr_data_109
create_bd_pin -dir I -from 63 -to 0 corr_data_110
create_bd_pin -dir I -from 63 -to 0 corr_data_111
create_bd_pin -dir I -from 511 -to 0 demap_data7
create_bd_pin -dir I -from 1 -to 0 corr_valid7
create_bd_pin -dir I -from 63 -to 0 corr_data_112
create_bd_pin -dir I -from 63 -to 0 corr_data_113
create_bd_pin -dir I -from 63 -to 0 corr_data_114
create_bd_pin -dir I -from 63 -to 0 corr_data_115
create_bd_pin -dir I -from 63 -to 0 corr_data_116
create_bd_pin -dir I -from 63 -to 0 corr_data_117
create_bd_pin -dir I -from 63 -to 0 corr_data_118
create_bd_pin -dir I -from 63 -to 0 corr_data_119
create_bd_pin -dir I -from 63 -to 0 corr_data_120
create_bd_pin -dir I -from 63 -to 0 corr_data_121
create_bd_pin -dir I -from 63 -to 0 corr_data_122
create_bd_pin -dir I -from 63 -to 0 corr_data_123
create_bd_pin -dir I -from 63 -to 0 corr_data_124
create_bd_pin -dir I -from 63 -to 0 corr_data_125
create_bd_pin -dir I -from 63 -to 0 corr_data_126
create_bd_pin -dir I -from 63 -to 0 corr_data_127
create_bd_pin -dir O noise_valid
create_bd_pin -dir O -from 31 -to 0 noise_data_0
create_bd_pin -dir O -from 31 -to 0 noise_data_1
create_bd_pin -dir O -from 31 -to 0 noise_data_2
create_bd_pin -dir O -from 31 -to 0 noise_data_3
create_bd_pin -dir O -from 31 -to 0 noise_data_4
create_bd_pin -dir O -from 31 -to 0 noise_data_5
create_bd_pin -dir O -from 31 -to 0 noise_data_6
create_bd_pin -dir O -from 31 -to 0 noise_data_7
create_bd_pin -dir O -from 31 -to 0 noise_data_8
create_bd_pin -dir O -from 31 -to 0 noise_data_9
create_bd_pin -dir O -from 31 -to 0 noise_data_10
create_bd_pin -dir O -from 31 -to 0 noise_data_11
create_bd_pin -dir O -from 31 -to 0 noise_data_12
create_bd_pin -dir O -from 31 -to 0 noise_data_13
create_bd_pin -dir O -from 31 -to 0 noise_data_14
create_bd_pin -dir O -from 31 -to 0 noise_data_15
create_bd_pin -dir O noise_valid1
create_bd_pin -dir O -from 31 -to 0 noise_data_16
create_bd_pin -dir O -from 31 -to 0 noise_data_17
create_bd_pin -dir O -from 31 -to 0 noise_data_18
create_bd_pin -dir O -from 31 -to 0 noise_data_19
create_bd_pin -dir O -from 31 -to 0 noise_data_20
create_bd_pin -dir O -from 31 -to 0 noise_data_21
create_bd_pin -dir O -from 31 -to 0 noise_data_22
create_bd_pin -dir O -from 31 -to 0 noise_data_23
create_bd_pin -dir O -from 31 -to 0 noise_data_24
create_bd_pin -dir O -from 31 -to 0 noise_data_25
create_bd_pin -dir O -from 31 -to 0 noise_data_26
create_bd_pin -dir O -from 31 -to 0 noise_data_27
create_bd_pin -dir O -from 31 -to 0 noise_data_28
create_bd_pin -dir O -from 31 -to 0 noise_data_29
create_bd_pin -dir O -from 31 -to 0 noise_data_30
create_bd_pin -dir O -from 31 -to 0 noise_data_31
create_bd_pin -dir O noise_valid2
create_bd_pin -dir O -from 31 -to 0 noise_data_32
create_bd_pin -dir O -from 31 -to 0 noise_data_33
create_bd_pin -dir O -from 31 -to 0 noise_data_34
create_bd_pin -dir O -from 31 -to 0 noise_data_35
create_bd_pin -dir O -from 31 -to 0 noise_data_36
create_bd_pin -dir O -from 31 -to 0 noise_data_37
create_bd_pin -dir O -from 31 -to 0 noise_data_38
create_bd_pin -dir O -from 31 -to 0 noise_data_39
create_bd_pin -dir O -from 31 -to 0 noise_data_40
create_bd_pin -dir O -from 31 -to 0 noise_data_41
create_bd_pin -dir O -from 31 -to 0 noise_data_42
create_bd_pin -dir O -from 31 -to 0 noise_data_43
create_bd_pin -dir O -from 31 -to 0 noise_data_44
create_bd_pin -dir O -from 31 -to 0 noise_data_45
create_bd_pin -dir O -from 31 -to 0 noise_data_46
create_bd_pin -dir O -from 31 -to 0 noise_data_47
create_bd_pin -dir O noise_valid3
create_bd_pin -dir O -from 31 -to 0 noise_data_48
create_bd_pin -dir O -from 31 -to 0 noise_data_49
create_bd_pin -dir O -from 31 -to 0 noise_data_50
create_bd_pin -dir O -from 31 -to 0 noise_data_51
create_bd_pin -dir O -from 31 -to 0 noise_data_52
create_bd_pin -dir O -from 31 -to 0 noise_data_53
create_bd_pin -dir O -from 31 -to 0 noise_data_54
create_bd_pin -dir O -from 31 -to 0 noise_data_55
create_bd_pin -dir O -from 31 -to 0 noise_data_56
create_bd_pin -dir O -from 31 -to 0 noise_data_57
create_bd_pin -dir O -from 31 -to 0 noise_data_58
create_bd_pin -dir O -from 31 -to 0 noise_data_59
create_bd_pin -dir O -from 31 -to 0 noise_data_60
create_bd_pin -dir O -from 31 -to 0 noise_data_61
create_bd_pin -dir O -from 31 -to 0 noise_data_62
create_bd_pin -dir O -from 31 -to 0 noise_data_63
create_bd_pin -dir O noise_valid4
create_bd_pin -dir O -from 31 -to 0 noise_data_64
create_bd_pin -dir O -from 31 -to 0 noise_data_65
create_bd_pin -dir O -from 31 -to 0 noise_data_66
create_bd_pin -dir O -from 31 -to 0 noise_data_67
create_bd_pin -dir O -from 31 -to 0 noise_data_68
create_bd_pin -dir O -from 31 -to 0 noise_data_69
create_bd_pin -dir O -from 31 -to 0 noise_data_70
create_bd_pin -dir O -from 31 -to 0 noise_data_71
create_bd_pin -dir O -from 31 -to 0 noise_data_72
create_bd_pin -dir O -from 31 -to 0 noise_data_73
create_bd_pin -dir O -from 31 -to 0 noise_data_74
create_bd_pin -dir O -from 31 -to 0 noise_data_75
create_bd_pin -dir O -from 31 -to 0 noise_data_76
create_bd_pin -dir O -from 31 -to 0 noise_data_77
create_bd_pin -dir O -from 31 -to 0 noise_data_78
create_bd_pin -dir O -from 31 -to 0 noise_data_79
create_bd_pin -dir O noise_valid5
create_bd_pin -dir O -from 31 -to 0 noise_data_80
create_bd_pin -dir O -from 31 -to 0 noise_data_81
create_bd_pin -dir O -from 31 -to 0 noise_data_82
create_bd_pin -dir O -from 31 -to 0 noise_data_83
create_bd_pin -dir O -from 31 -to 0 noise_data_84
create_bd_pin -dir O -from 31 -to 0 noise_data_85
create_bd_pin -dir O -from 31 -to 0 noise_data_86
create_bd_pin -dir O -from 31 -to 0 noise_data_87
create_bd_pin -dir O -from 31 -to 0 noise_data_88
create_bd_pin -dir O -from 31 -to 0 noise_data_89
create_bd_pin -dir O -from 31 -to 0 noise_data_90
create_bd_pin -dir O -from 31 -to 0 noise_data_91
create_bd_pin -dir O -from 31 -to 0 noise_data_92
create_bd_pin -dir O -from 31 -to 0 noise_data_93
create_bd_pin -dir O -from 31 -to 0 noise_data_94
create_bd_pin -dir O -from 31 -to 0 noise_data_95
create_bd_pin -dir O noise_valid6
create_bd_pin -dir O -from 31 -to 0 noise_data_96
create_bd_pin -dir O -from 31 -to 0 noise_data_97
create_bd_pin -dir O -from 31 -to 0 noise_data_98
create_bd_pin -dir O -from 31 -to 0 noise_data_99
create_bd_pin -dir O -from 31 -to 0 noise_data_100
create_bd_pin -dir O -from 31 -to 0 noise_data_101
create_bd_pin -dir O -from 31 -to 0 noise_data_102
create_bd_pin -dir O -from 31 -to 0 noise_data_103
create_bd_pin -dir O -from 31 -to 0 noise_data_104
create_bd_pin -dir O -from 31 -to 0 noise_data_105
create_bd_pin -dir O -from 31 -to 0 noise_data_106
create_bd_pin -dir O -from 31 -to 0 noise_data_107
create_bd_pin -dir O -from 31 -to 0 noise_data_108
create_bd_pin -dir O -from 31 -to 0 noise_data_109
create_bd_pin -dir O -from 31 -to 0 noise_data_110
create_bd_pin -dir O -from 31 -to 0 noise_data_111
create_bd_pin -dir O noise_valid7
create_bd_pin -dir O -from 31 -to 0 noise_data_112
create_bd_pin -dir O -from 31 -to 0 noise_data_113
create_bd_pin -dir O -from 31 -to 0 noise_data_114
create_bd_pin -dir O -from 31 -to 0 noise_data_115
create_bd_pin -dir O -from 31 -to 0 noise_data_116
create_bd_pin -dir O -from 31 -to 0 noise_data_117
create_bd_pin -dir O -from 31 -to 0 noise_data_118
create_bd_pin -dir O -from 31 -to 0 noise_data_119
create_bd_pin -dir O -from 31 -to 0 noise_data_120
create_bd_pin -dir O -from 31 -to 0 noise_data_121
create_bd_pin -dir O -from 31 -to 0 noise_data_122
create_bd_pin -dir O -from 31 -to 0 noise_data_123
create_bd_pin -dir O -from 31 -to 0 noise_data_124
create_bd_pin -dir O -from 31 -to 0 noise_data_125
create_bd_pin -dir O -from 31 -to 0 noise_data_126
create_bd_pin -dir O -from 31 -to 0 noise_data_127
